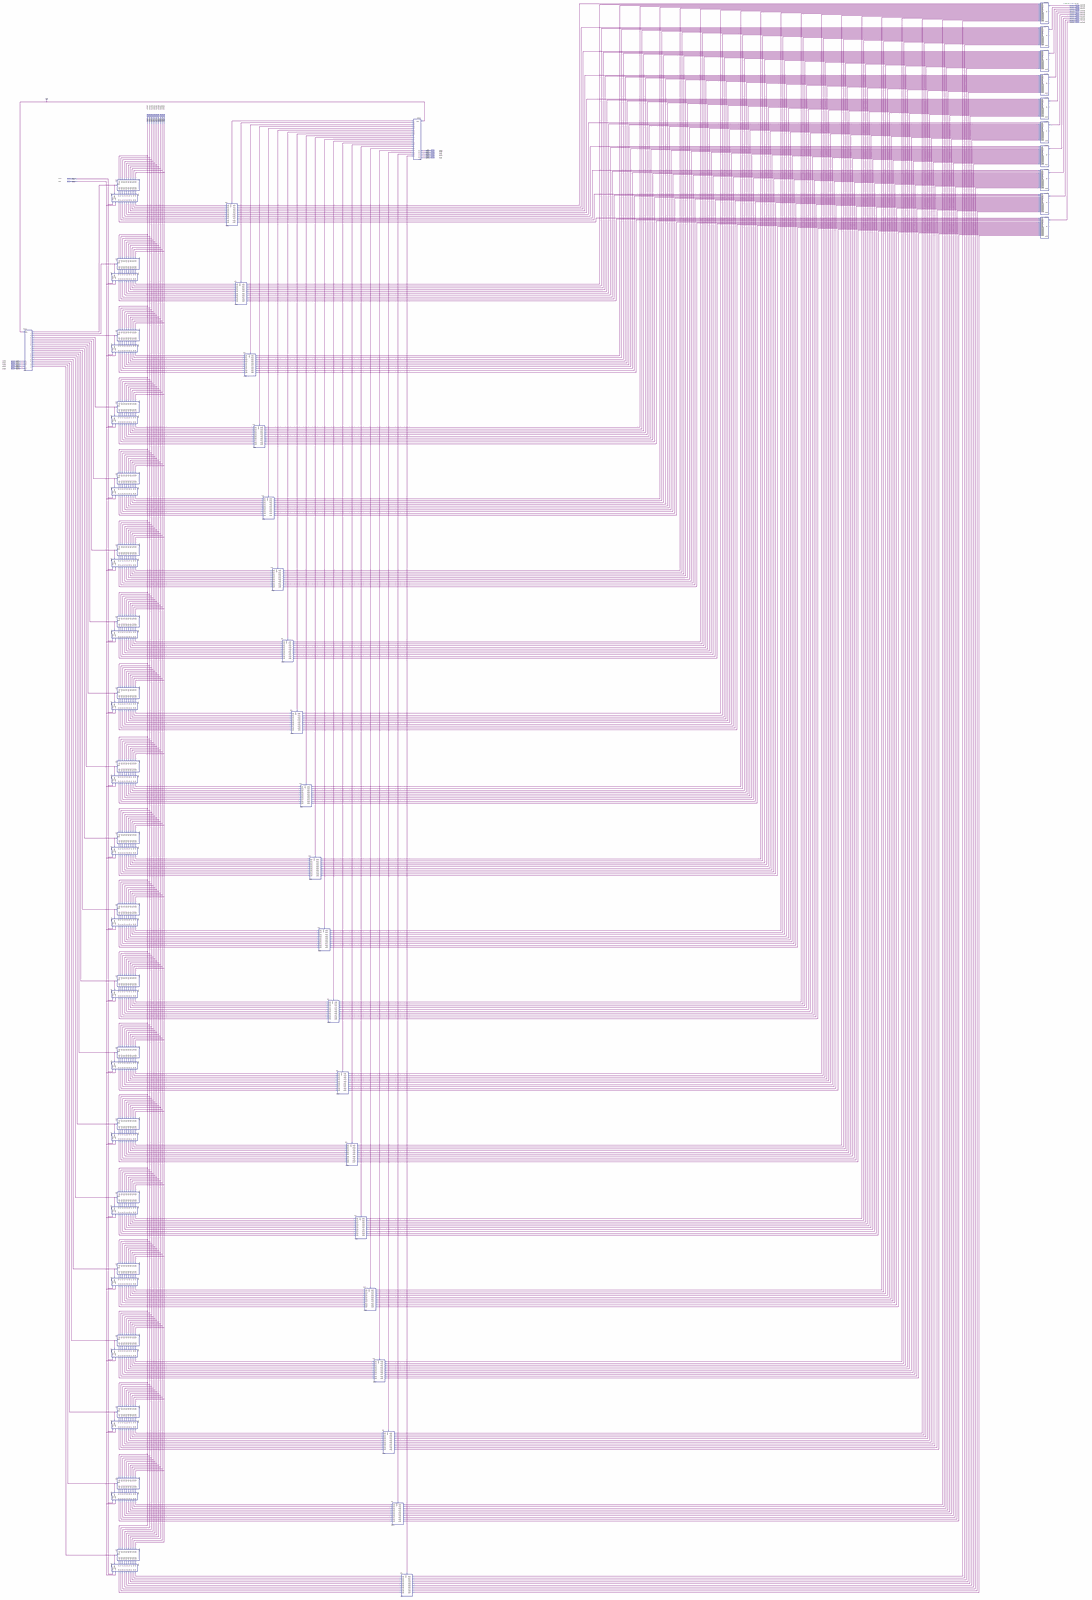
[diagram p0: schematic sheet, whole]
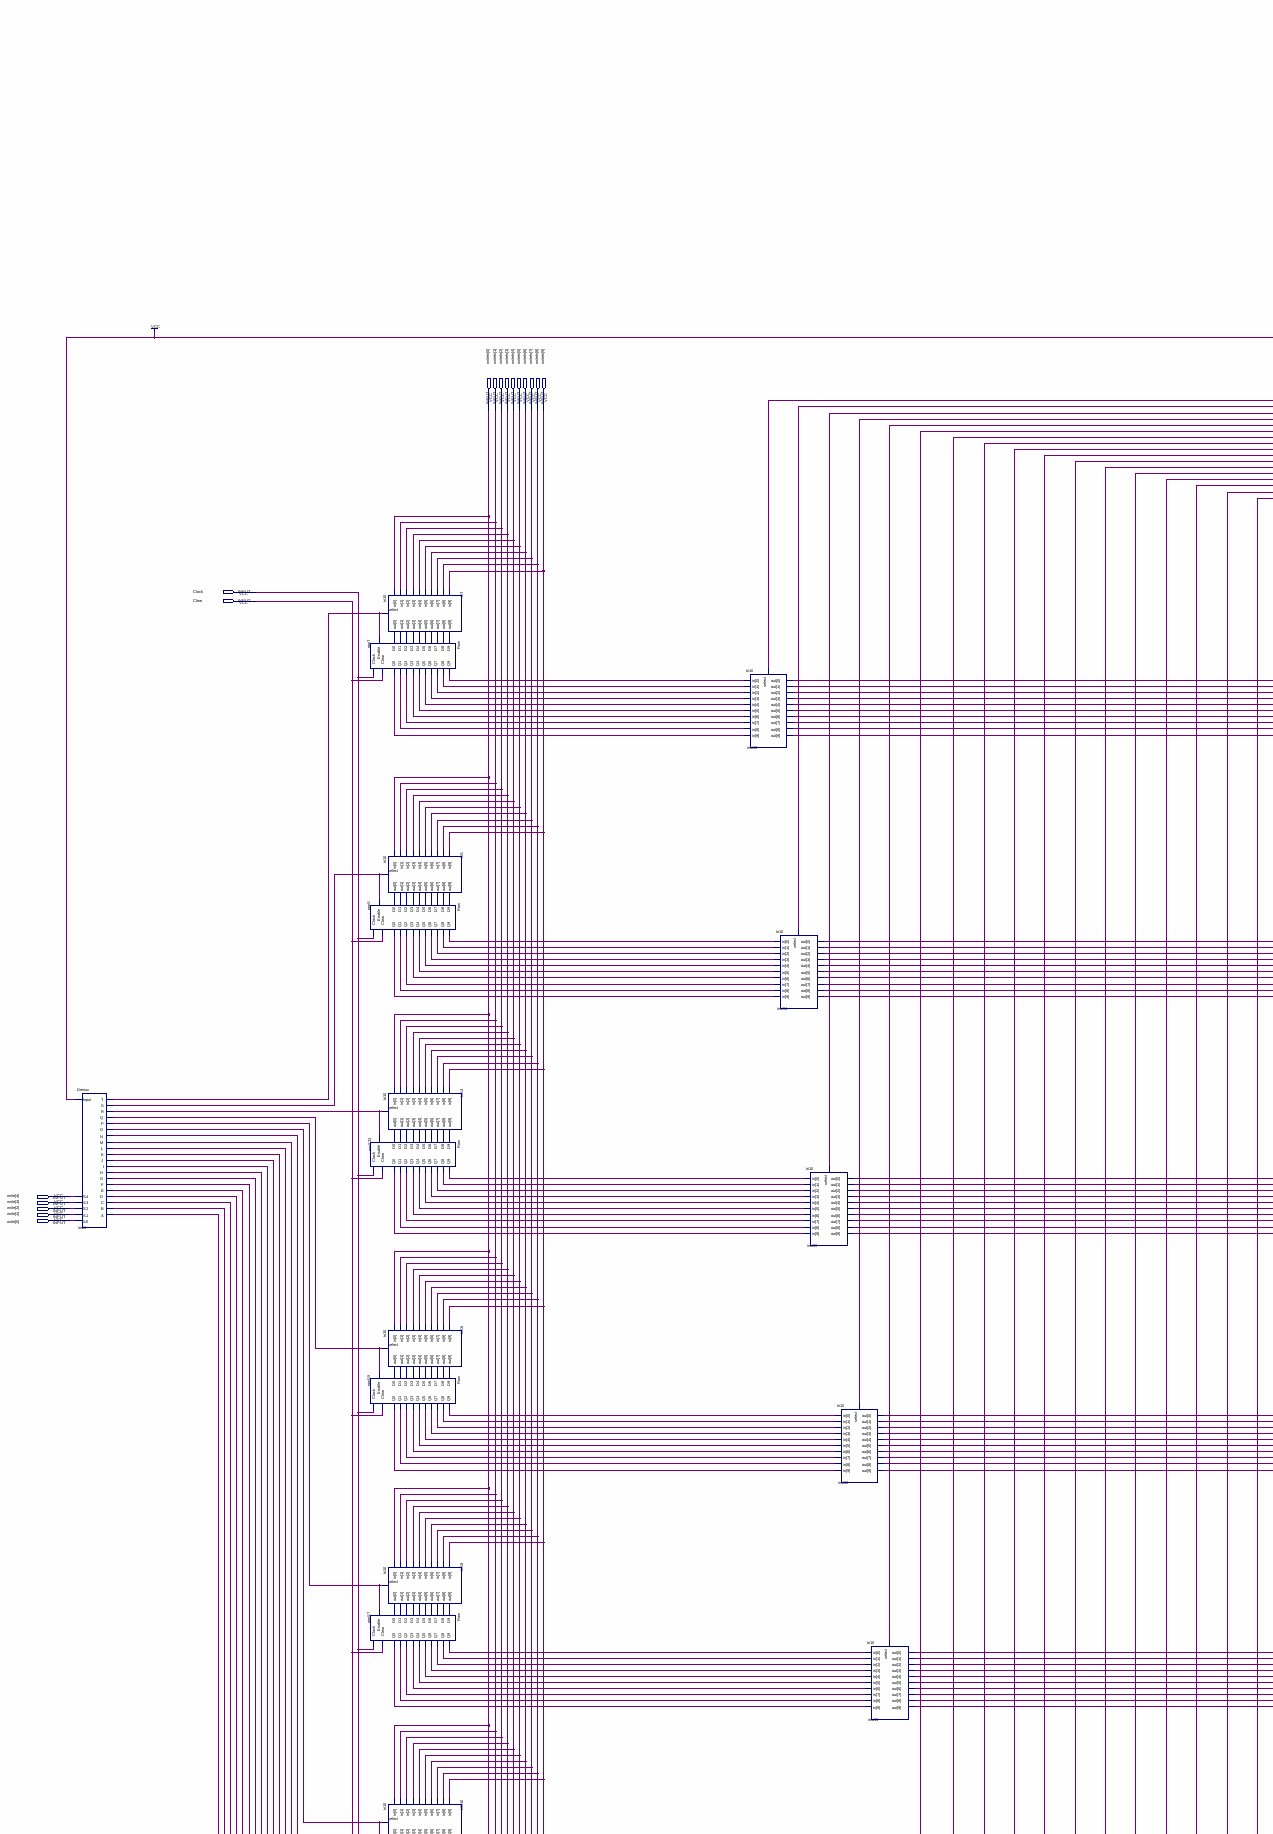
[diagram p1: schematic sheet, upper left part]
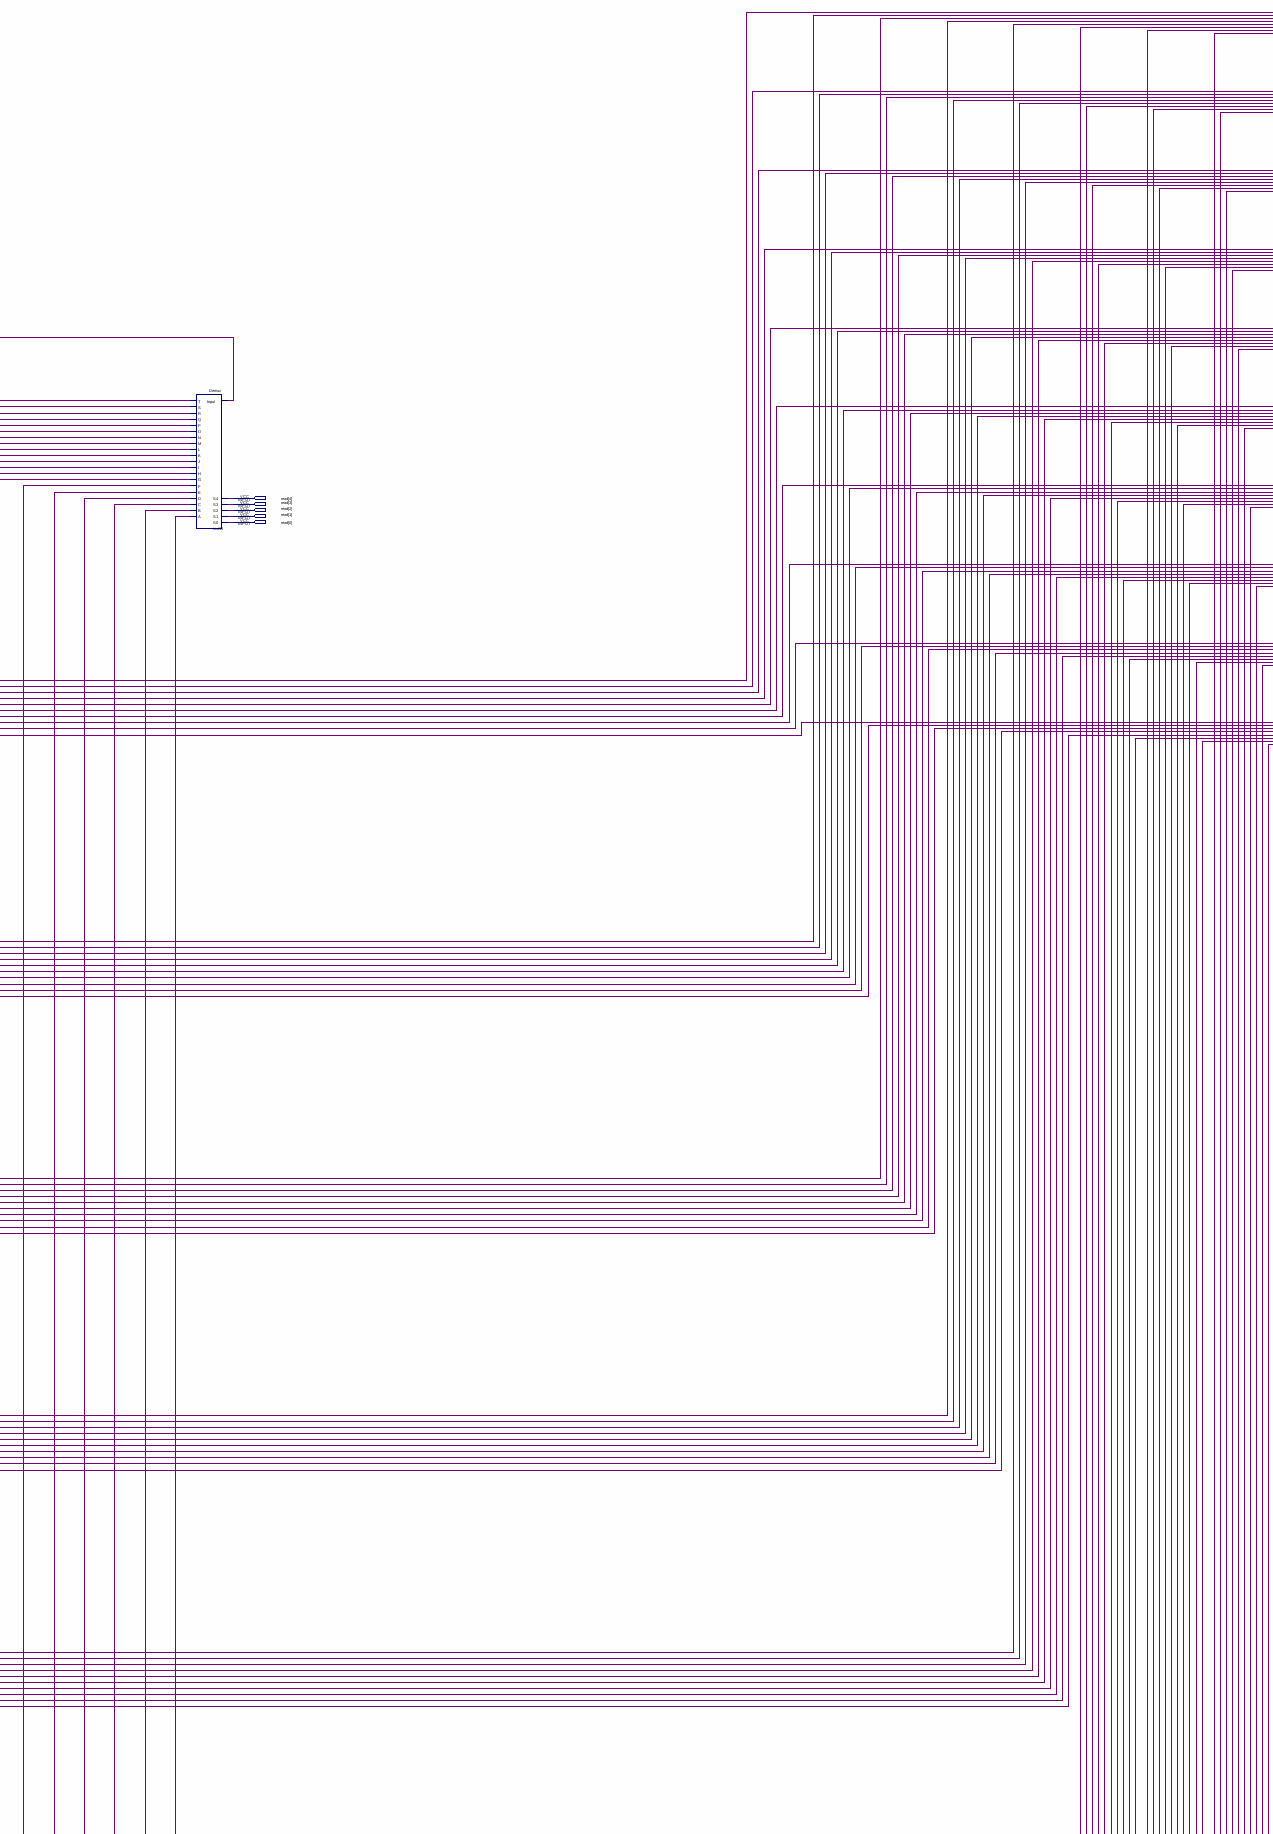
[diagram p2: schematic sheet, upper centre part]
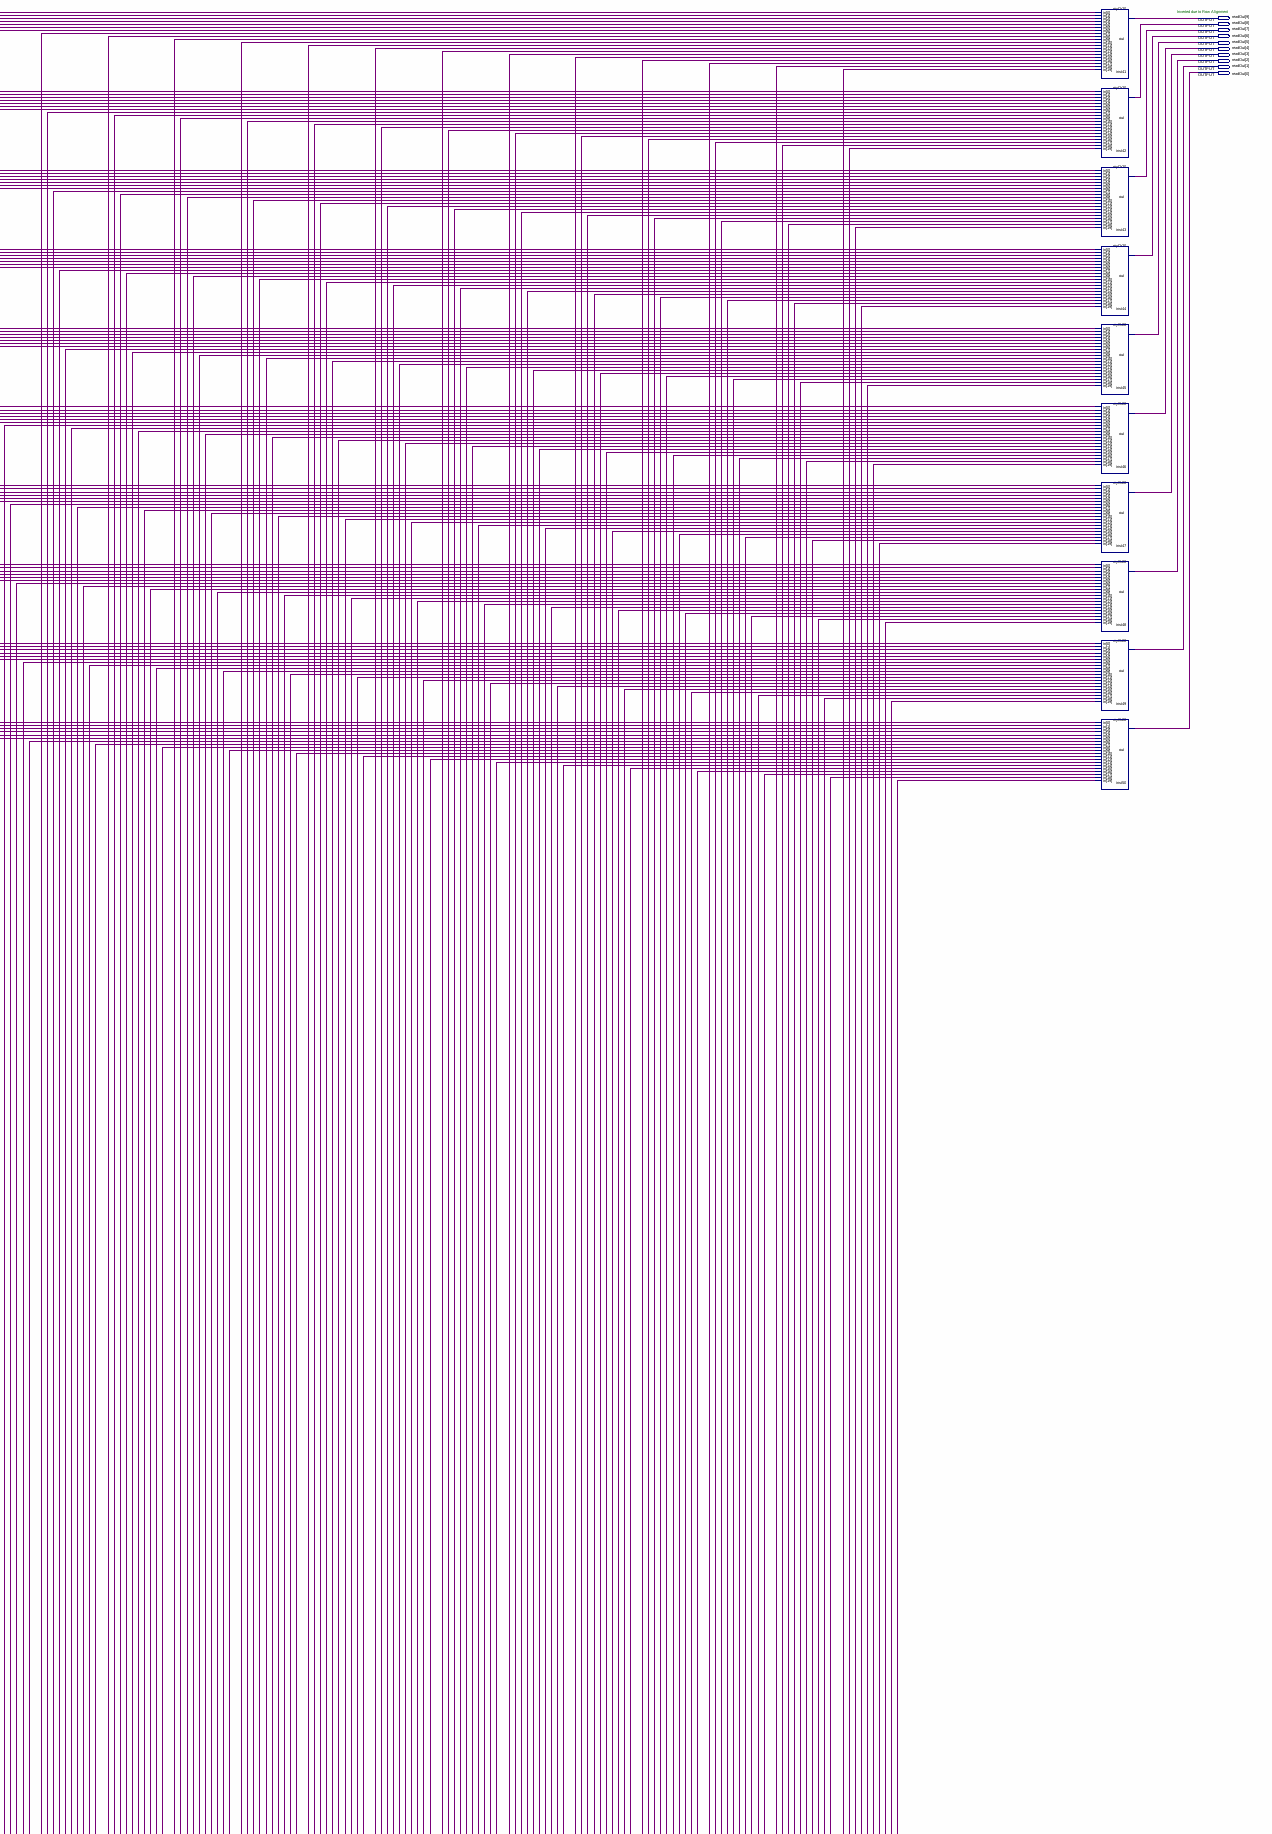
[diagram p3: schematic sheet, upper right part]
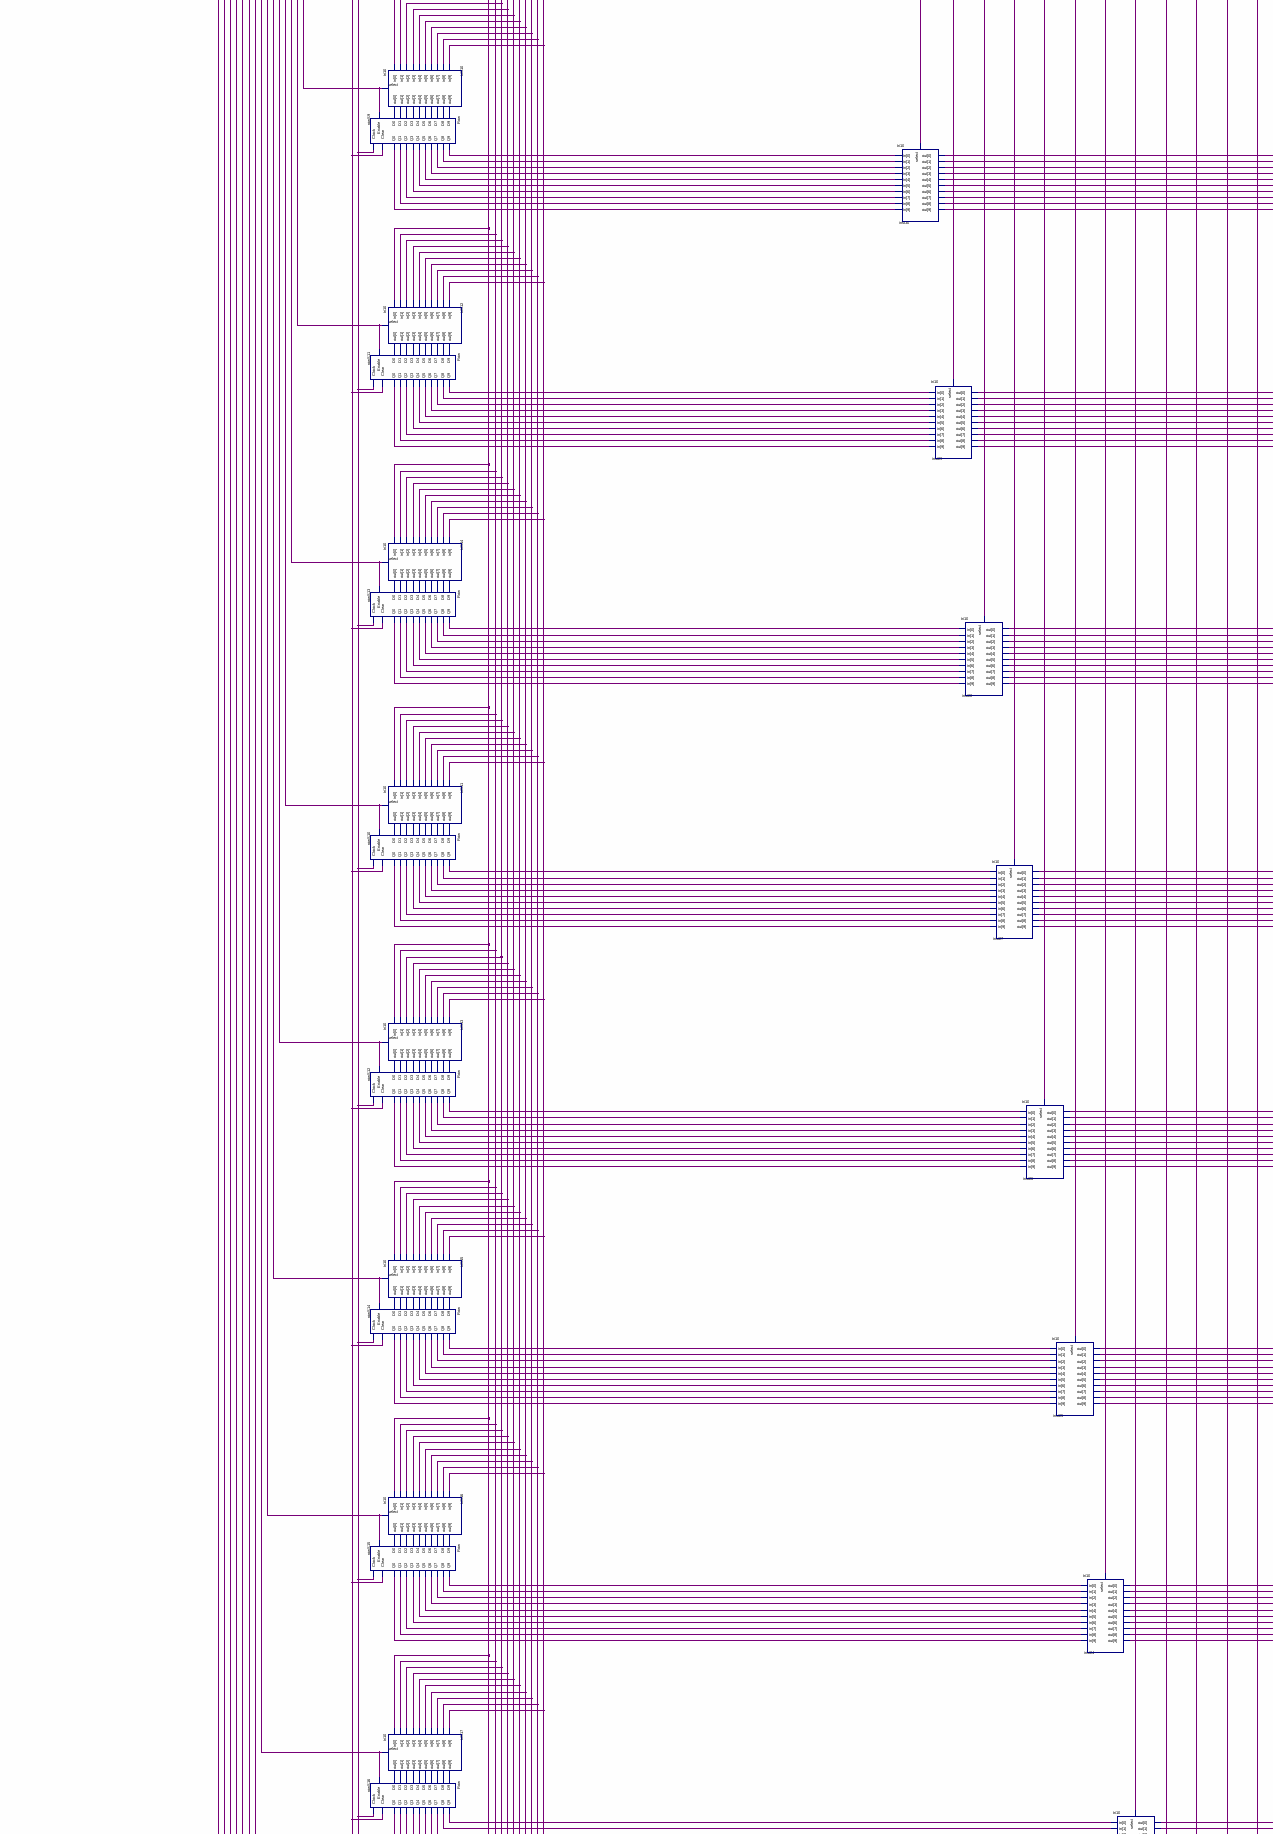
[diagram p4: schematic sheet, middle left part]
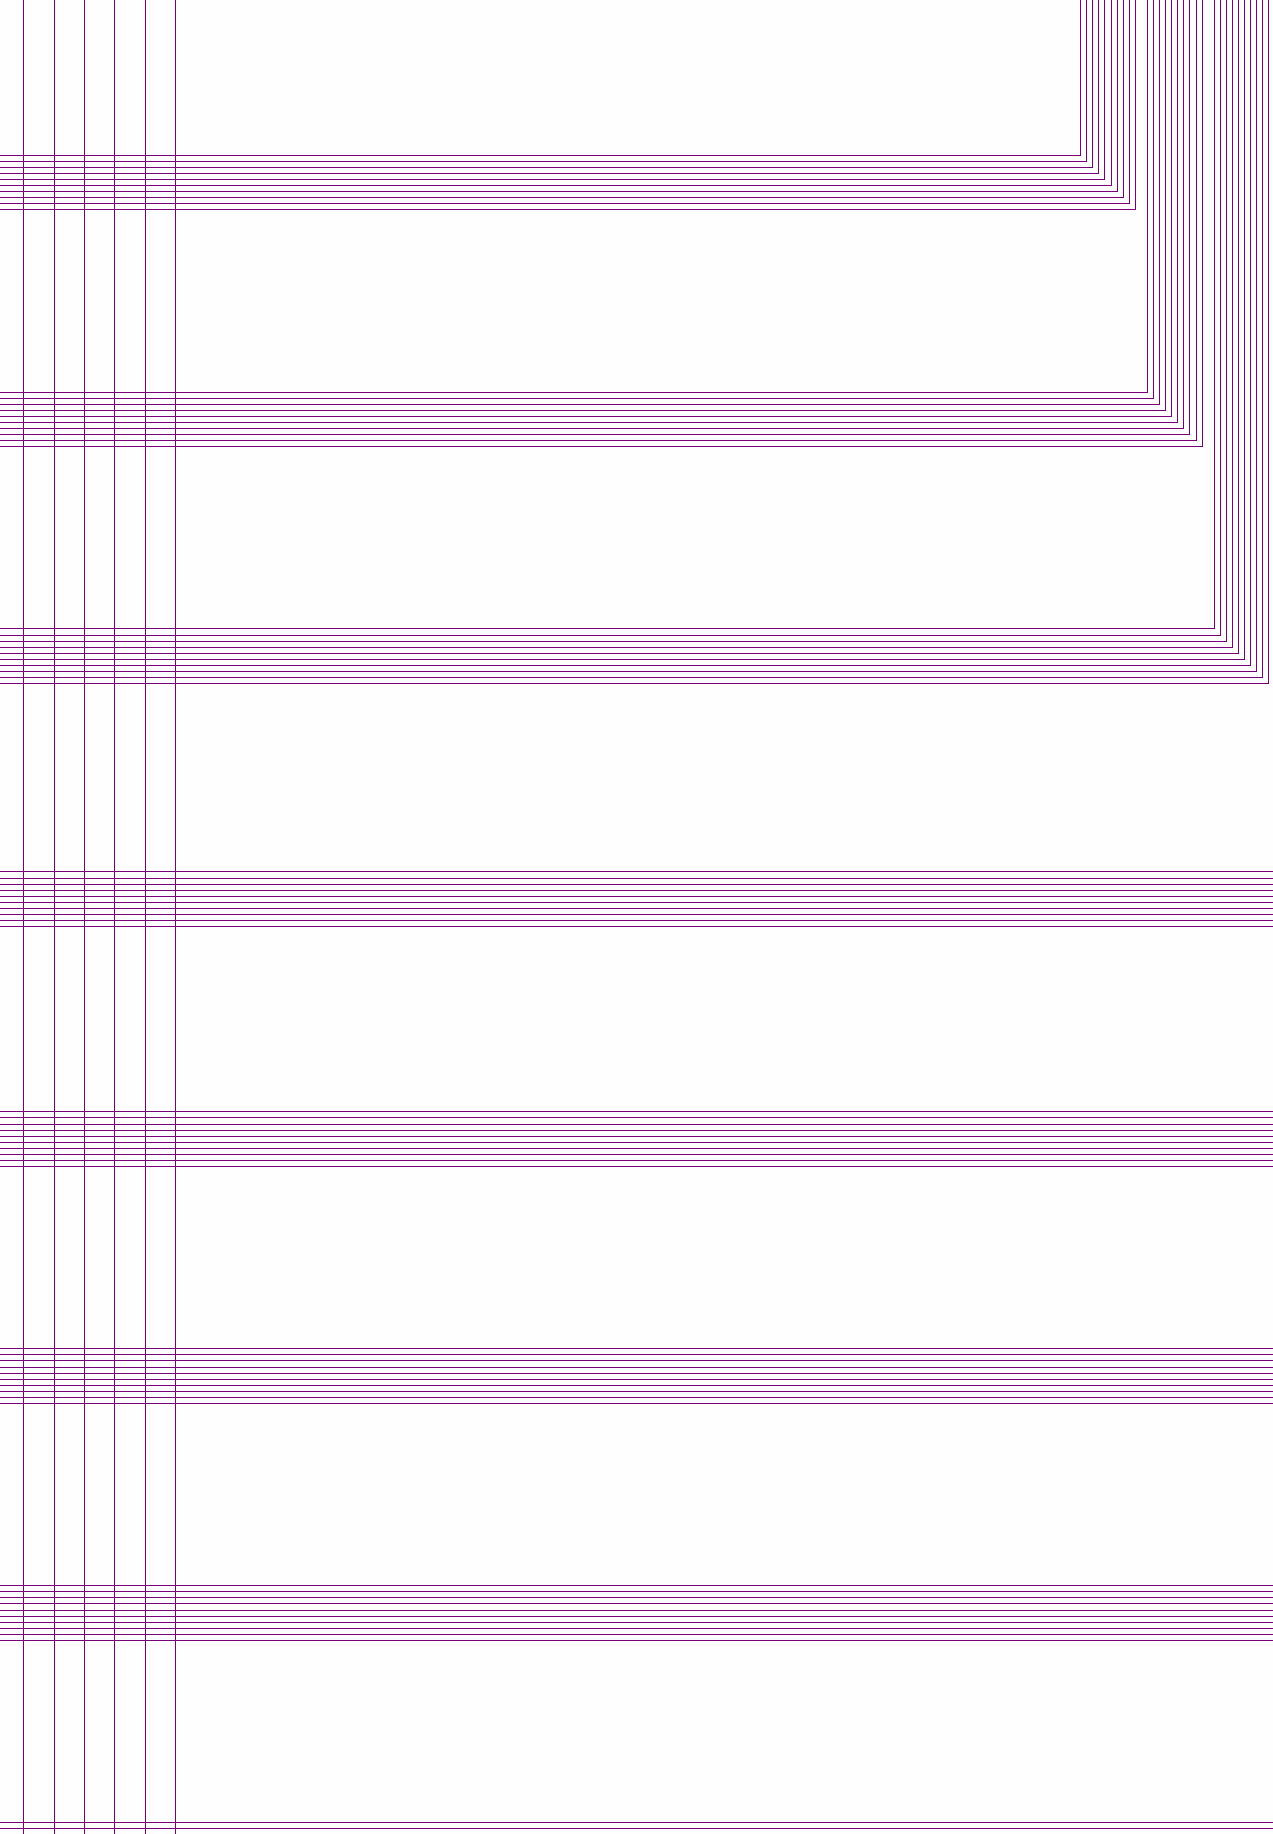
[diagram p5: schematic sheet, middle centre part]
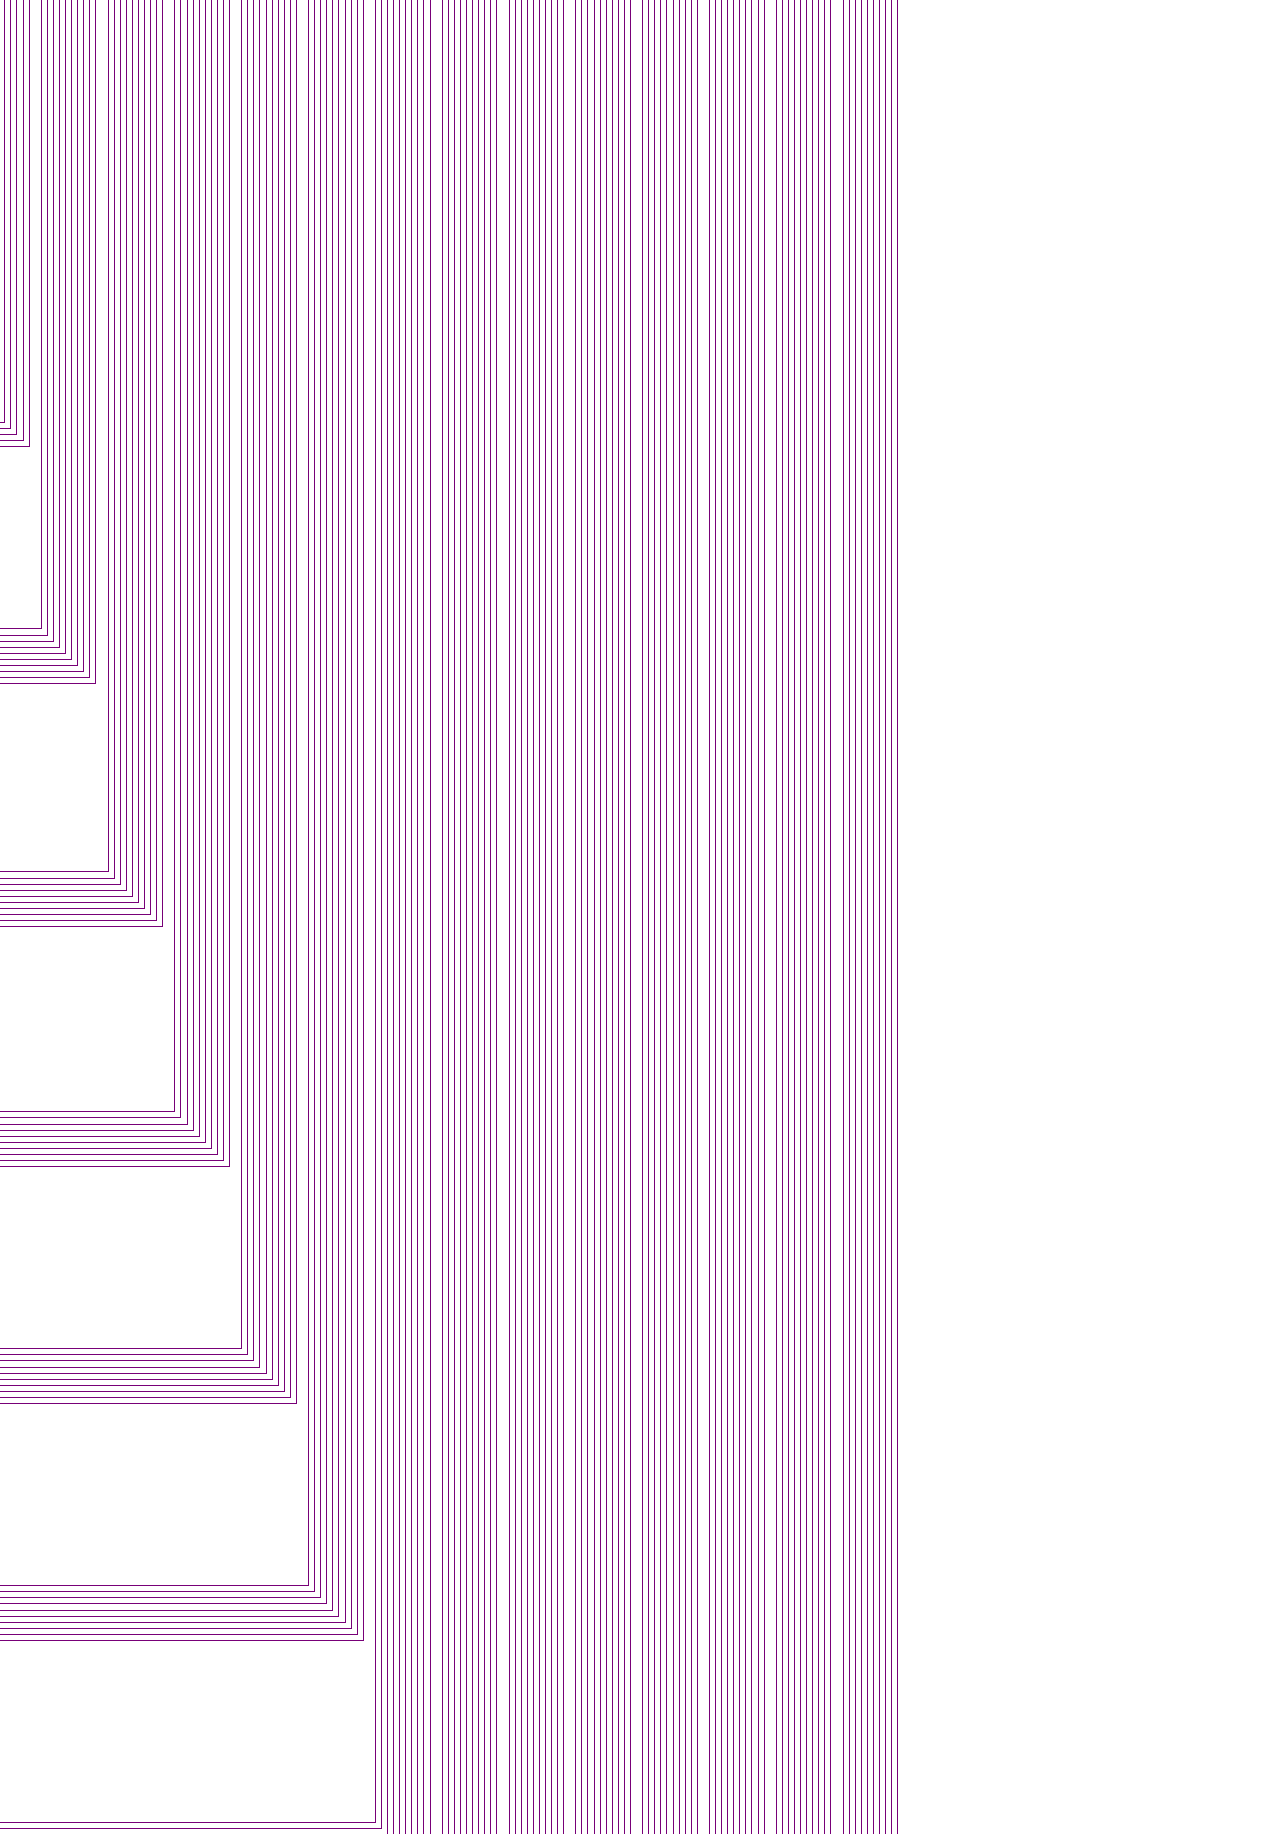
[diagram p6: schematic sheet, middle right part]
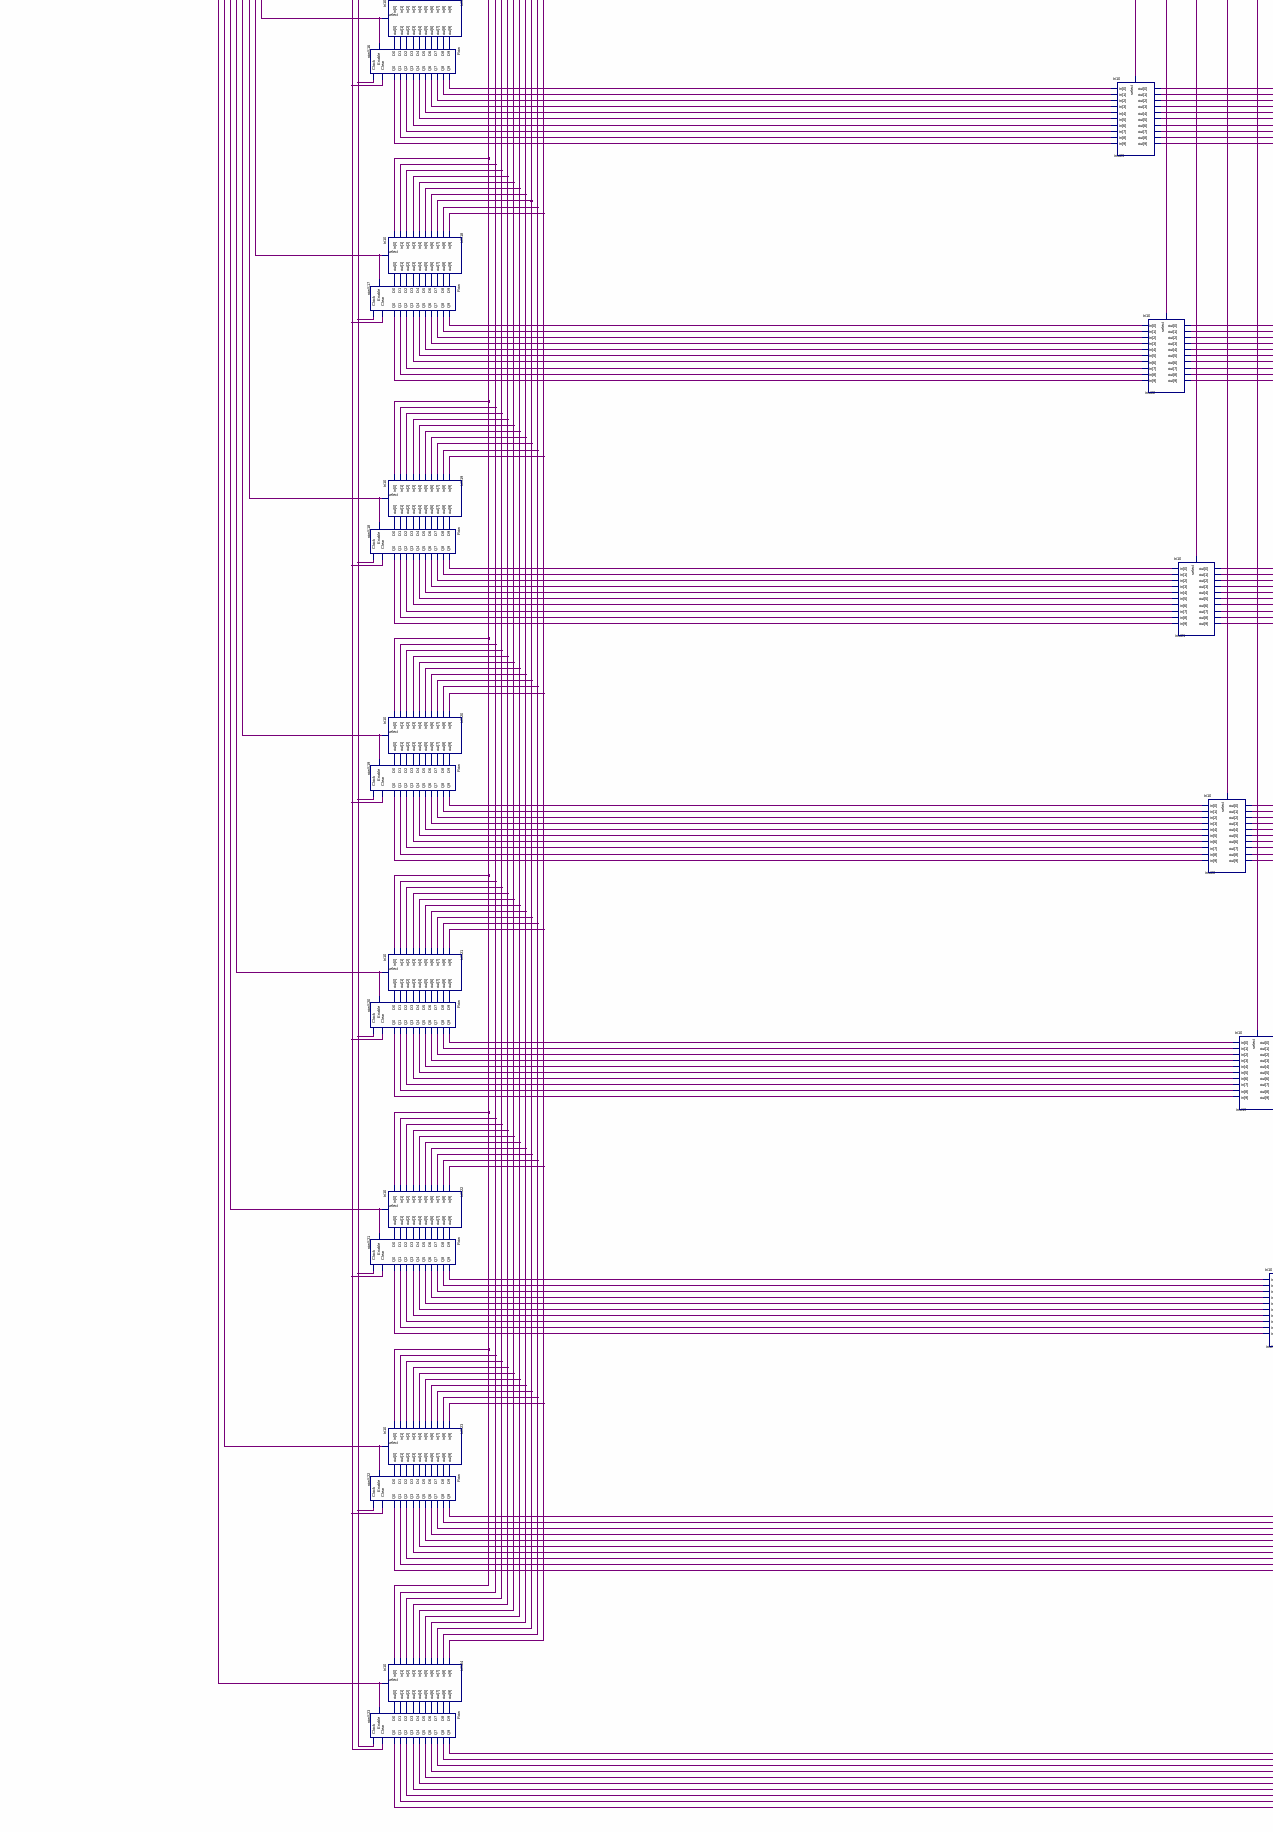
[diagram p7: schematic sheet, lower left part]
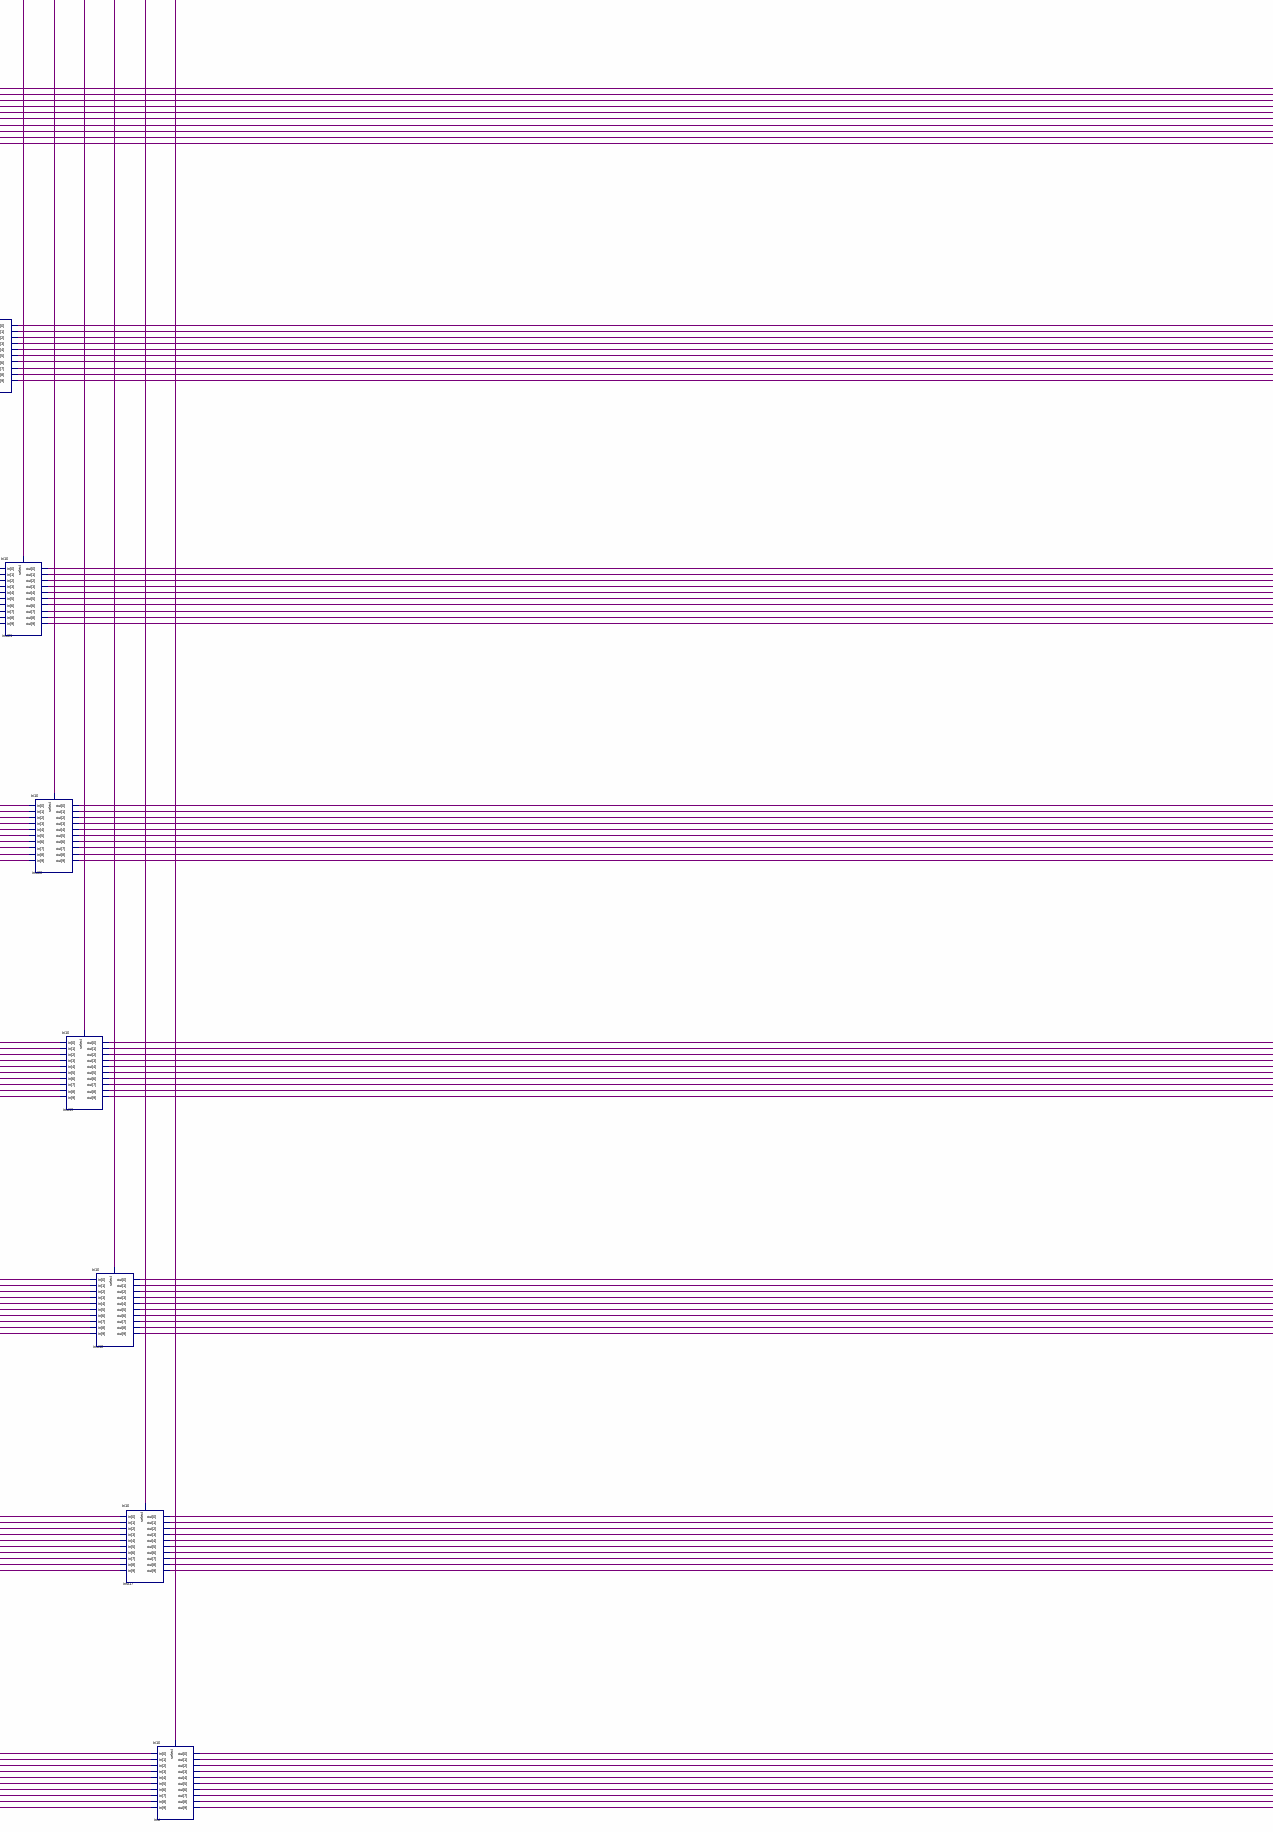
[diagram p8: schematic sheet, lower centre part]
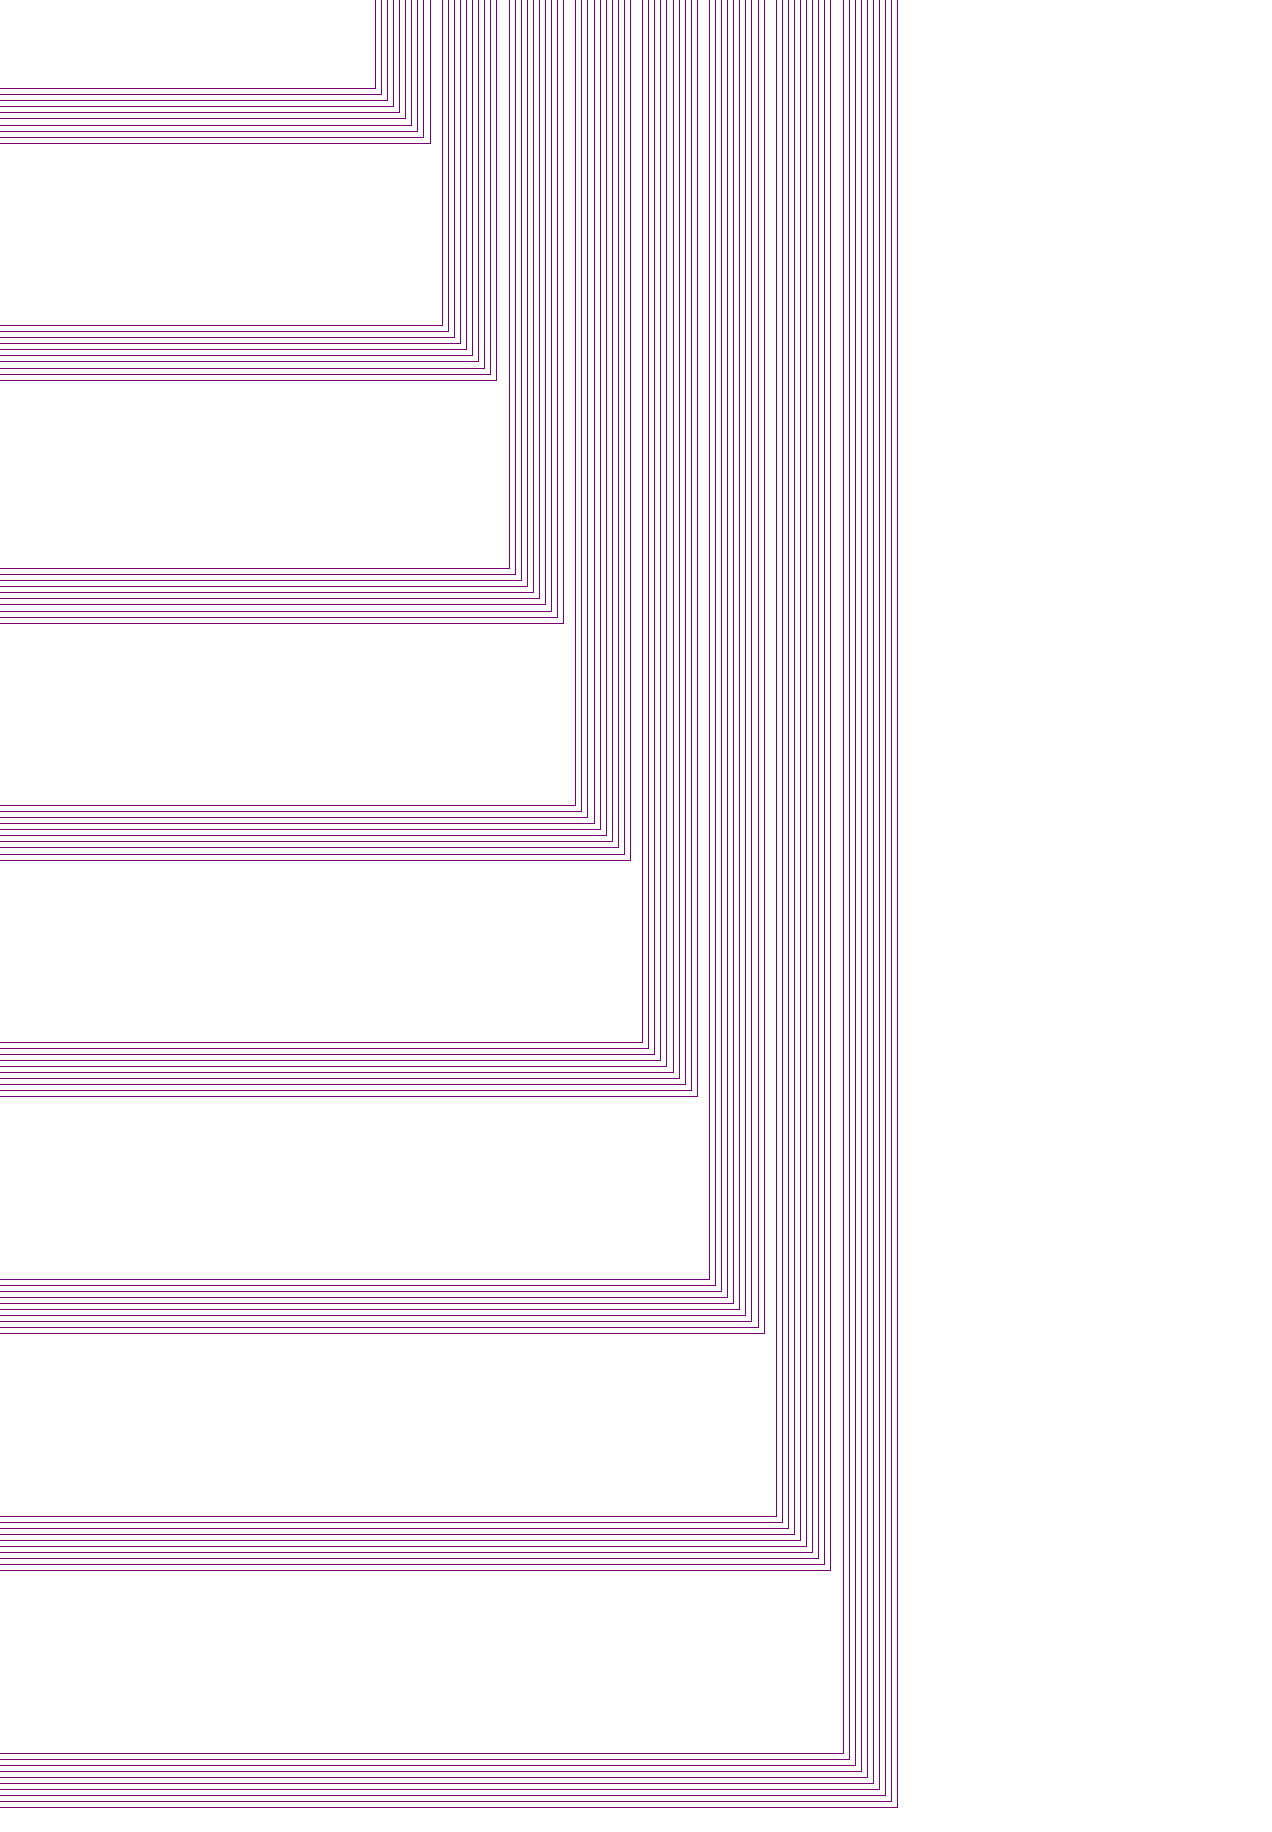
[diagram p9: schematic sheet, lower right part]
// Quartus schematic GameBoard.bdf as structural Verilog: 72 symbols, 32 pins
module GameBoard (
  input  [9:0] writeIn,
  input  [4:0] read,
  input  Clock,
  input  Clear,
  input  [4:0] write,
  output [9:0] readOut
);

  wire inst1_a, inst1_b, inst1_c, inst1_d, inst1_e, inst1_f, inst1_g, inst1_h, inst1_i, inst1_j, inst1_k,
       inst1_l, inst1_m, inst1_n, inst1_o, inst1_p, inst1_q, inst1_r, inst1_s, inst1_t, inst15_a, inst15_b,
       inst15_c, inst15_d, inst15_e, inst15_f, inst15_g, inst15_h, inst15_i, inst15_j, inst15_k, inst15_l,
       inst15_m, inst15_n, inst15_o, inst15_p, inst15_q, inst15_r, inst15_s, inst15_t, inst17_out,
       inst17_out_2, inst17_out_3, inst17_out_4, inst17_out_5, inst17_out_6, inst17_out_7, inst17_out_8,
       inst17_out_9, inst17_out_10, inst18_out, inst18_out_2, inst18_out_3, inst18_out_4, inst18_out_5,
       inst18_out_6, inst18_out_7, inst18_out_8, inst18_out_9, inst18_out_10, inst19_out, inst19_out_2,
       inst19_out_3, inst19_out_4, inst19_out_5, inst19_out_6, inst19_out_7, inst19_out_8, inst19_out_9,
       inst19_out_10, inst20_out, inst20_out_2, inst20_out_3, inst20_out_4, inst20_out_5, inst20_out_6,
       inst20_out_7, inst20_out_8, inst20_out_9, inst20_out_10, inst21_out, inst21_out_2, inst21_out_3,
       inst21_out_4, inst21_out_5, inst21_out_6, inst21_out_7, inst21_out_8, inst21_out_9, inst21_out_10,
       inst22_out, inst22_out_2, inst22_out_3, inst22_out_4, inst22_out_5, inst22_out_6, inst22_out_7,
       inst22_out_8, inst22_out_9, inst22_out_10, inst23_out, inst23_out_2, inst23_out_3, inst23_out_4,
       inst23_out_5, inst23_out_6, inst23_out_7, inst23_out_8, inst23_out_9, inst23_out_10, inst24_out,
       inst24_out_2, inst24_out_3, inst24_out_4, inst24_out_5, inst24_out_6, inst24_out_7, inst24_out_8,
       inst24_out_9, inst24_out_10, inst25_out, inst25_out_2, inst25_out_3, inst25_out_4, inst25_out_5,
       inst25_out_6, inst25_out_7, inst25_out_8, inst25_out_9, inst25_out_10, inst26_out, inst26_out_2,
       inst26_out_3, inst26_out_4, inst26_out_5, inst26_out_6, inst26_out_7, inst26_out_8, inst26_out_9,
       inst26_out_10, inst27_out, inst27_out_2, inst27_out_3, inst27_out_4, inst27_out_5, inst27_out_6,
       inst27_out_7, inst27_out_8, inst27_out_9, inst27_out_10, inst28_out, inst28_out_2, inst28_out_3,
       inst28_out_4, inst28_out_5, inst28_out_6, inst28_out_7, inst28_out_8, inst28_out_9, inst28_out_10,
       inst29_out, inst29_out_2, inst29_out_3, inst29_out_4, inst29_out_5, inst29_out_6, inst29_out_7,
       inst29_out_8, inst29_out_9, inst29_out_10, inst30_out, inst30_out_2, inst30_out_3, inst30_out_4,
       inst30_out_5, inst30_out_6, inst30_out_7, inst30_out_8, inst30_out_9, inst30_out_10, inst31_out,
       inst31_out_2, inst31_out_3, inst31_out_4, inst31_out_5, inst31_out_6, inst31_out_7, inst31_out_8,
       inst31_out_9, inst31_out_10, inst32_out, inst32_out_2, inst32_out_3, inst32_out_4, inst32_out_5,
       inst32_out_6, inst32_out_7, inst32_out_8, inst32_out_9, inst32_out_10, inst33_out, inst33_out_2,
       inst33_out_3, inst33_out_4, inst33_out_5, inst33_out_6, inst33_out_7, inst33_out_8, inst33_out_9,
       inst33_out_10, inst34_out, inst34_out_2, inst34_out_3, inst34_out_4, inst34_out_5, inst34_out_6,
       inst34_out_7, inst34_out_8, inst34_out_9, inst34_out_10, inst35_out, inst35_out_2, inst35_out_3,
       inst35_out_4, inst35_out_5, inst35_out_6, inst35_out_7, inst35_out_8, inst35_out_9, inst35_out_10,
       inst_out, inst_out_2, inst_out_3, inst_out_4, inst_out_5, inst_out_6, inst_out_7, inst_out_8,
       inst_out_9, inst_out_10, rowS5_q0, rowS5_q1, rowS5_q2, rowS5_q3, rowS5_q4, rowS5_q5, rowS5_q6,
       rowS5_q7, rowS5_q8, rowS5_q9, rowS7_q0, rowS7_q1, rowS7_q2, rowS7_q3, rowS7_q4, rowS7_q5, rowS7_q6,
       rowS7_q7, rowS7_q8, rowS7_q9, rowS9_q0, rowS9_q1, rowS9_q2, rowS9_q3, rowS9_q4, rowS9_q5, rowS9_q6,
       rowS9_q7, rowS9_q8, rowS9_q9, rowS10_q0, rowS10_q1, rowS10_q2, rowS10_q3, rowS10_q4, rowS10_q5,
       rowS10_q6, rowS10_q7, rowS10_q8, rowS10_q9, rowS11_q0, rowS11_q1, rowS11_q2, rowS11_q3, rowS11_q4,
       rowS11_q5, rowS11_q6, rowS11_q7, rowS11_q8, rowS11_q9, rowS12_q0, rowS12_q1, rowS12_q2, rowS12_q3,
       rowS12_q4, rowS12_q5, rowS12_q6, rowS12_q7, rowS12_q8, rowS12_q9, rowS13_q0, rowS13_q1, rowS13_q2,
       rowS13_q3, rowS13_q4, rowS13_q5, rowS13_q6, rowS13_q7, rowS13_q8, rowS13_q9, rowS14_q0, rowS14_q1,
       rowS14_q2, rowS14_q3, rowS14_q4, rowS14_q5, rowS14_q6, rowS14_q7, rowS14_q8, rowS14_q9, rowS15_q0,
       rowS15_q1, rowS15_q2, rowS15_q3, rowS15_q4, rowS15_q5, rowS15_q6, rowS15_q7, rowS15_q8, rowS15_q9,
       rowS16_q0, rowS16_q1, rowS16_q2, rowS16_q3, rowS16_q4, rowS16_q5, rowS16_q6, rowS16_q7, rowS16_q8,
       rowS16_q9, rowS17_q0, rowS17_q1, rowS17_q2, rowS17_q3, rowS17_q4, rowS17_q5, rowS17_q6, rowS17_q7,
       rowS17_q8, rowS17_q9, rowS18_q0, rowS18_q1, rowS18_q2, rowS18_q3, rowS18_q4, rowS18_q5, rowS18_q6,
       rowS18_q7, rowS18_q8, rowS18_q9, rowS19_q0, rowS19_q1, rowS19_q2, rowS19_q3, rowS19_q4, rowS19_q5,
       rowS19_q6, rowS19_q7, rowS19_q8, rowS19_q9, rowS20_q0, rowS20_q1, rowS20_q2, rowS20_q3, rowS20_q4,
       rowS20_q5, rowS20_q6, rowS20_q7, rowS20_q8, rowS20_q9, rowS21_q0, rowS21_q1, rowS21_q2, rowS21_q3,
       rowS21_q4, rowS21_q5, rowS21_q6, rowS21_q7, rowS21_q8, rowS21_q9, rowS22_q0, rowS22_q1, rowS22_q2,
       rowS22_q3, rowS22_q4, rowS22_q5, rowS22_q6, rowS22_q7, rowS22_q8, rowS22_q9, rowS23_q0, rowS23_q1,
       rowS23_q2, rowS23_q3, rowS23_q4, rowS23_q5, rowS23_q6, rowS23_q7, rowS23_q8, rowS23_q9, rowS33_q0,
       rowS33_q1, rowS33_q2, rowS33_q3, rowS33_q4, rowS33_q5, rowS33_q6, rowS33_q7, rowS33_q8, rowS33_q9,
       rowS_q0, rowS_q1, rowS_q2, rowS_q3, rowS_q4, rowS_q5, rowS_q6, rowS_q7, rowS_q8, rowS_q9, rowT_q0,
       rowT_q1, rowT_q2, rowT_q3, rowT_q4, rowT_q5, rowT_q6, rowT_q7, rowT_q8, rowT_q9, triS4_out,
       triS4_out_2, triS4_out_3, triS4_out_4, triS4_out_5, triS4_out_6, triS4_out_7, triS4_out_8,
       triS4_out_9, triS4_out_10, triS6_out, triS6_out_2, triS6_out_3, triS6_out_4, triS6_out_5, triS6_out_6,
       triS6_out_7, triS6_out_8, triS6_out_9, triS6_out_10, triS8_out, triS8_out_2, triS8_out_3, triS8_out_4,
       triS8_out_5, triS8_out_6, triS8_out_7, triS8_out_8, triS8_out_9, triS8_out_10, triS10_out,
       triS10_out_2, triS10_out_3, triS10_out_4, triS10_out_5, triS10_out_6, triS10_out_7, triS10_out_8,
       triS10_out_9, triS10_out_10, triS11_out, triS11_out_2, triS11_out_3, triS11_out_4, triS11_out_5,
       triS11_out_6, triS11_out_7, triS11_out_8, triS11_out_9, triS11_out_10, triS12_out, triS12_out_2,
       triS12_out_3, triS12_out_4, triS12_out_5, triS12_out_6, triS12_out_7, triS12_out_8, triS12_out_9,
       triS12_out_10, triS13_out, triS13_out_2, triS13_out_3, triS13_out_4, triS13_out_5, triS13_out_6,
       triS13_out_7, triS13_out_8, triS13_out_9, triS13_out_10, triS14_out, triS14_out_2, triS14_out_3,
       triS14_out_4, triS14_out_5, triS14_out_6, triS14_out_7, triS14_out_8, triS14_out_9, triS14_out_10,
       triS15_out, triS15_out_2, triS15_out_3, triS15_out_4, triS15_out_5, triS15_out_6, triS15_out_7,
       triS15_out_8, triS15_out_9, triS15_out_10, triS16_out, triS16_out_2, triS16_out_3, triS16_out_4,
       triS16_out_5, triS16_out_6, triS16_out_7, triS16_out_8, triS16_out_9, triS16_out_10, triS17_out,
       triS17_out_2, triS17_out_3, triS17_out_4, triS17_out_5, triS17_out_6, triS17_out_7, triS17_out_8,
       triS17_out_9, triS17_out_10, triS18_out, triS18_out_2, triS18_out_3, triS18_out_4, triS18_out_5,
       triS18_out_6, triS18_out_7, triS18_out_8, triS18_out_9, triS18_out_10, triS19_out, triS19_out_2,
       triS19_out_3, triS19_out_4, triS19_out_5, triS19_out_6, triS19_out_7, triS19_out_8, triS19_out_9,
       triS19_out_10, triS20_out, triS20_out_2, triS20_out_3, triS20_out_4, triS20_out_5, triS20_out_6,
       triS20_out_7, triS20_out_8, triS20_out_9, triS20_out_10, triS21_out, triS21_out_2, triS21_out_3,
       triS21_out_4, triS21_out_5, triS21_out_6, triS21_out_7, triS21_out_8, triS21_out_9, triS21_out_10,
       triS22_out, triS22_out_2, triS22_out_3, triS22_out_4, triS22_out_5, triS22_out_6, triS22_out_7,
       triS22_out_8, triS22_out_9, triS22_out_10, triS23_out, triS23_out_2, triS23_out_3, triS23_out_4,
       triS23_out_5, triS23_out_6, triS23_out_7, triS23_out_8, triS23_out_9, triS23_out_10, triS24_out,
       triS24_out_2, triS24_out_3, triS24_out_4, triS24_out_5, triS24_out_6, triS24_out_7, triS24_out_8,
       triS24_out_9, triS24_out_10, triS_out, triS_out_2, triS_out_3, triS_out_4, triS_out_5, triS_out_6,
       triS_out_7, triS_out_8, triS_out_9, triS_out_10, triT_out, triT_out_2, triT_out_3, triT_out_4,
       triT_out_5, triT_out_6, triT_out_7, triT_out_8, triT_out_9, triT_out_10;

  Demux inst1 (
    .S4(write[4]), .S3(write[3]), .S2(write[2]), .S1(write[1]), .S0(write[0]), .Input(1'b1), .T(inst1_t),
    .S(inst1_s), .R(inst1_r), .Q(inst1_q), .P(inst1_p), .O(inst1_o), .N(inst1_n), .M(inst1_m), .L(inst1_l),
    .K(inst1_k), .J(inst1_j), .I(inst1_i), .H(inst1_h), .G(inst1_g), .F(inst1_f), .E(inst1_e), .D(inst1_d),
    .C(inst1_c), .B(inst1_b), .A(inst1_a));
  tri10 triT (
    .in(writeIn), .select(inst1_t),
    .out({triT_out_10, triT_out_9, triT_out_8, triT_out_7, triT_out_6, triT_out_5, triT_out_4, triT_out_3, triT_out_2, triT_out}));
  Row rowT (
    .D1(triT_out_2), .D3(triT_out_4), .D4(triT_out_5), .D5(triT_out_6), .D6(triT_out_7), .D7(triT_out_8),
    .D0(triT_out), .D2(triT_out_3), .D9(triT_out_10), .D8(triT_out_9), .Enable(inst1_t), .Clock(Clock),
    .Clear(Clear), .Q0(rowT_q0), .Q1(rowT_q1), .Q2(rowT_q2), .Q3(rowT_q3), .Q4(rowT_q4), .Q5(rowT_q5),
    .Q6(rowT_q6), .Q7(rowT_q7), .Q8(rowT_q8), .Q9(rowT_q9));
  tri10 triS (
    .in(writeIn), .select(inst1_s),
    .out({triS_out_10, triS_out_9, triS_out_8, triS_out_7, triS_out_6, triS_out_5, triS_out_4, triS_out_3, triS_out_2, triS_out}));
  Row rowS (
    .D1(triS_out_2), .D3(triS_out_4), .D4(triS_out_5), .D5(triS_out_6), .D6(triS_out_7), .D7(triS_out_8),
    .D0(triS_out), .D2(triS_out_3), .D9(triS_out_10), .D8(triS_out_9), .Enable(inst1_s), .Clock(Clock),
    .Clear(Clear), .Q0(rowS_q0), .Q1(rowS_q1), .Q2(rowS_q2), .Q3(rowS_q3), .Q4(rowS_q4), .Q5(rowS_q5),
    .Q6(rowS_q6), .Q7(rowS_q7), .Q8(rowS_q8), .Q9(rowS_q9));
  tri10 triS4 (
    .in(writeIn), .select(inst1_r),
    .out({triS4_out_10, triS4_out_9, triS4_out_8, triS4_out_7, triS4_out_6, triS4_out_5, triS4_out_4, triS4_out_3, triS4_out_2, triS4_out}));
  Row rowS33 (
    .D1(triS4_out_2), .D3(triS4_out_4), .D4(triS4_out_5), .D5(triS4_out_6), .D6(triS4_out_7),
    .D7(triS4_out_8), .D0(triS4_out), .D2(triS4_out_3), .D9(triS4_out_10), .D8(triS4_out_9),
    .Enable(inst1_r), .Clock(Clock), .Clear(Clear), .Q0(rowS33_q0), .Q1(rowS33_q1), .Q2(rowS33_q2),
    .Q3(rowS33_q3), .Q4(rowS33_q4), .Q5(rowS33_q5), .Q6(rowS33_q6), .Q7(rowS33_q7), .Q8(rowS33_q8),
    .Q9(rowS33_q9));
  tri10 triS6 (
    .in(writeIn), .select(inst1_q),
    .out({triS6_out_10, triS6_out_9, triS6_out_8, triS6_out_7, triS6_out_6, triS6_out_5, triS6_out_4, triS6_out_3, triS6_out_2, triS6_out}));
  Row rowS5 (
    .D1(triS6_out_2), .D3(triS6_out_4), .D4(triS6_out_5), .D5(triS6_out_6), .D6(triS6_out_7),
    .D7(triS6_out_8), .D0(triS6_out), .D2(triS6_out_3), .D9(triS6_out_10), .D8(triS6_out_9),
    .Enable(inst1_q), .Clock(Clock), .Clear(Clear), .Q0(rowS5_q0), .Q1(rowS5_q1), .Q2(rowS5_q2),
    .Q3(rowS5_q3), .Q4(rowS5_q4), .Q5(rowS5_q5), .Q6(rowS5_q6), .Q7(rowS5_q7), .Q8(rowS5_q8), .Q9(rowS5_q9));
  tri10 triS8 (
    .in(writeIn), .select(inst1_p),
    .out({triS8_out_10, triS8_out_9, triS8_out_8, triS8_out_7, triS8_out_6, triS8_out_5, triS8_out_4, triS8_out_3, triS8_out_2, triS8_out}));
  Row rowS7 (
    .D1(triS8_out_2), .D3(triS8_out_4), .D4(triS8_out_5), .D5(triS8_out_6), .D6(triS8_out_7),
    .D7(triS8_out_8), .D0(triS8_out), .D2(triS8_out_3), .D9(triS8_out_10), .D8(triS8_out_9),
    .Enable(inst1_p), .Clock(Clock), .Clear(Clear), .Q0(rowS7_q0), .Q1(rowS7_q1), .Q2(rowS7_q2),
    .Q3(rowS7_q3), .Q4(rowS7_q4), .Q5(rowS7_q5), .Q6(rowS7_q6), .Q7(rowS7_q7), .Q8(rowS7_q8), .Q9(rowS7_q9));
  tri10 triS10 (
    .in(writeIn), .select(inst1_o),
    .out({triS10_out_10, triS10_out_9, triS10_out_8, triS10_out_7, triS10_out_6, triS10_out_5, triS10_out_4, triS10_out_3, triS10_out_2, triS10_out}));
  Row rowS9 (
    .D1(triS10_out_2), .D3(triS10_out_4), .D4(triS10_out_5), .D5(triS10_out_6), .D6(triS10_out_7),
    .D7(triS10_out_8), .D0(triS10_out), .D2(triS10_out_3), .D9(triS10_out_10), .D8(triS10_out_9),
    .Enable(inst1_o), .Clock(Clock), .Clear(Clear), .Q0(rowS9_q0), .Q1(rowS9_q1), .Q2(rowS9_q2),
    .Q3(rowS9_q3), .Q4(rowS9_q4), .Q5(rowS9_q5), .Q6(rowS9_q6), .Q7(rowS9_q7), .Q8(rowS9_q8), .Q9(rowS9_q9));
  tri10 triS12 (
    .in(writeIn), .select(inst1_n),
    .out({triS12_out_10, triS12_out_9, triS12_out_8, triS12_out_7, triS12_out_6, triS12_out_5, triS12_out_4, triS12_out_3, triS12_out_2, triS12_out}));
  Row rowS11 (
    .D1(triS12_out_2), .D3(triS12_out_4), .D4(triS12_out_5), .D5(triS12_out_6), .D6(triS12_out_7),
    .D7(triS12_out_8), .D0(triS12_out), .D2(triS12_out_3), .D9(triS12_out_10), .D8(triS12_out_9),
    .Enable(inst1_n), .Clock(Clock), .Clear(Clear), .Q0(rowS11_q0), .Q1(rowS11_q1), .Q2(rowS11_q2),
    .Q3(rowS11_q3), .Q4(rowS11_q4), .Q5(rowS11_q5), .Q6(rowS11_q6), .Q7(rowS11_q7), .Q8(rowS11_q8),
    .Q9(rowS11_q9));
  tri10 triS14 (
    .in(writeIn), .select(inst1_m),
    .out({triS14_out_10, triS14_out_9, triS14_out_8, triS14_out_7, triS14_out_6, triS14_out_5, triS14_out_4, triS14_out_3, triS14_out_2, triS14_out}));
  Row rowS13 (
    .D1(triS14_out_2), .D3(triS14_out_4), .D4(triS14_out_5), .D5(triS14_out_6), .D6(triS14_out_7),
    .D7(triS14_out_8), .D0(triS14_out), .D2(triS14_out_3), .D9(triS14_out_10), .D8(triS14_out_9),
    .Enable(inst1_m), .Clock(Clock), .Clear(Clear), .Q0(rowS13_q0), .Q1(rowS13_q1), .Q2(rowS13_q2),
    .Q3(rowS13_q3), .Q4(rowS13_q4), .Q5(rowS13_q5), .Q6(rowS13_q6), .Q7(rowS13_q7), .Q8(rowS13_q8),
    .Q9(rowS13_q9));
  tri10 triS11 (
    .in(writeIn), .select(inst1_l),
    .out({triS11_out_10, triS11_out_9, triS11_out_8, triS11_out_7, triS11_out_6, triS11_out_5, triS11_out_4, triS11_out_3, triS11_out_2, triS11_out}));
  Row rowS10 (
    .D1(triS11_out_2), .D3(triS11_out_4), .D4(triS11_out_5), .D5(triS11_out_6), .D6(triS11_out_7),
    .D7(triS11_out_8), .D0(triS11_out), .D2(triS11_out_3), .D9(triS11_out_10), .D8(triS11_out_9),
    .Enable(inst1_l), .Clock(Clock), .Clear(Clear), .Q0(rowS10_q0), .Q1(rowS10_q1), .Q2(rowS10_q2),
    .Q3(rowS10_q3), .Q4(rowS10_q4), .Q5(rowS10_q5), .Q6(rowS10_q6), .Q7(rowS10_q7), .Q8(rowS10_q8),
    .Q9(rowS10_q9));
  tri10 triS13 (
    .in(writeIn), .select(inst1_k),
    .out({triS13_out_10, triS13_out_9, triS13_out_8, triS13_out_7, triS13_out_6, triS13_out_5, triS13_out_4, triS13_out_3, triS13_out_2, triS13_out}));
  Row rowS12 (
    .D1(triS13_out_2), .D3(triS13_out_4), .D4(triS13_out_5), .D5(triS13_out_6), .D6(triS13_out_7),
    .D7(triS13_out_8), .D0(triS13_out), .D2(triS13_out_3), .D9(triS13_out_10), .D8(triS13_out_9),
    .Enable(inst1_k), .Clock(Clock), .Clear(Clear), .Q0(rowS12_q0), .Q1(rowS12_q1), .Q2(rowS12_q2),
    .Q3(rowS12_q3), .Q4(rowS12_q4), .Q5(rowS12_q5), .Q6(rowS12_q6), .Q7(rowS12_q7), .Q8(rowS12_q8),
    .Q9(rowS12_q9));
  tri10 triS15 (
    .in(writeIn), .select(inst1_j),
    .out({triS15_out_10, triS15_out_9, triS15_out_8, triS15_out_7, triS15_out_6, triS15_out_5, triS15_out_4, triS15_out_3, triS15_out_2, triS15_out}));
  Row rowS14 (
    .D1(triS15_out_2), .D3(triS15_out_4), .D4(triS15_out_5), .D5(triS15_out_6), .D6(triS15_out_7),
    .D7(triS15_out_8), .D0(triS15_out), .D2(triS15_out_3), .D9(triS15_out_10), .D8(triS15_out_9),
    .Enable(inst1_j), .Clock(Clock), .Clear(Clear), .Q0(rowS14_q0), .Q1(rowS14_q1), .Q2(rowS14_q2),
    .Q3(rowS14_q3), .Q4(rowS14_q4), .Q5(rowS14_q5), .Q6(rowS14_q6), .Q7(rowS14_q7), .Q8(rowS14_q8),
    .Q9(rowS14_q9));
  tri10 triS16 (
    .in(writeIn), .select(inst1_i),
    .out({triS16_out_10, triS16_out_9, triS16_out_8, triS16_out_7, triS16_out_6, triS16_out_5, triS16_out_4, triS16_out_3, triS16_out_2, triS16_out}));
  Row rowS15 (
    .D1(triS16_out_2), .D3(triS16_out_4), .D4(triS16_out_5), .D5(triS16_out_6), .D6(triS16_out_7),
    .D7(triS16_out_8), .D0(triS16_out), .D2(triS16_out_3), .D9(triS16_out_10), .D8(triS16_out_9),
    .Enable(inst1_i), .Clock(Clock), .Clear(Clear), .Q0(rowS15_q0), .Q1(rowS15_q1), .Q2(rowS15_q2),
    .Q3(rowS15_q3), .Q4(rowS15_q4), .Q5(rowS15_q5), .Q6(rowS15_q6), .Q7(rowS15_q7), .Q8(rowS15_q8),
    .Q9(rowS15_q9));
  tri10 triS17 (
    .in(writeIn), .select(inst1_h),
    .out({triS17_out_10, triS17_out_9, triS17_out_8, triS17_out_7, triS17_out_6, triS17_out_5, triS17_out_4, triS17_out_3, triS17_out_2, triS17_out}));
  Row rowS16 (
    .D1(triS17_out_2), .D3(triS17_out_4), .D4(triS17_out_5), .D5(triS17_out_6), .D6(triS17_out_7),
    .D7(triS17_out_8), .D0(triS17_out), .D2(triS17_out_3), .D9(triS17_out_10), .D8(triS17_out_9),
    .Enable(inst1_h), .Clock(Clock), .Clear(Clear), .Q0(rowS16_q0), .Q1(rowS16_q1), .Q2(rowS16_q2),
    .Q3(rowS16_q3), .Q4(rowS16_q4), .Q5(rowS16_q5), .Q6(rowS16_q6), .Q7(rowS16_q7), .Q8(rowS16_q8),
    .Q9(rowS16_q9));
  tri10 triS18 (
    .in(writeIn), .select(inst1_g),
    .out({triS18_out_10, triS18_out_9, triS18_out_8, triS18_out_7, triS18_out_6, triS18_out_5, triS18_out_4, triS18_out_3, triS18_out_2, triS18_out}));
  Row rowS17 (
    .D1(triS18_out_2), .D3(triS18_out_4), .D4(triS18_out_5), .D5(triS18_out_6), .D6(triS18_out_7),
    .D7(triS18_out_8), .D0(triS18_out), .D2(triS18_out_3), .D9(triS18_out_10), .D8(triS18_out_9),
    .Enable(inst1_g), .Clock(Clock), .Clear(Clear), .Q0(rowS17_q0), .Q1(rowS17_q1), .Q2(rowS17_q2),
    .Q3(rowS17_q3), .Q4(rowS17_q4), .Q5(rowS17_q5), .Q6(rowS17_q6), .Q7(rowS17_q7), .Q8(rowS17_q8),
    .Q9(rowS17_q9));
  tri10 triS19 (
    .in(writeIn), .select(inst1_f),
    .out({triS19_out_10, triS19_out_9, triS19_out_8, triS19_out_7, triS19_out_6, triS19_out_5, triS19_out_4, triS19_out_3, triS19_out_2, triS19_out}));
  Row rowS18 (
    .D1(triS19_out_2), .D3(triS19_out_4), .D4(triS19_out_5), .D5(triS19_out_6), .D6(triS19_out_7),
    .D7(triS19_out_8), .D0(triS19_out), .D2(triS19_out_3), .D9(triS19_out_10), .D8(triS19_out_9),
    .Enable(inst1_f), .Clock(Clock), .Clear(Clear), .Q0(rowS18_q0), .Q1(rowS18_q1), .Q2(rowS18_q2),
    .Q3(rowS18_q3), .Q4(rowS18_q4), .Q5(rowS18_q5), .Q6(rowS18_q6), .Q7(rowS18_q7), .Q8(rowS18_q8),
    .Q9(rowS18_q9));
  tri10 triS20 (
    .in(writeIn), .select(inst1_e),
    .out({triS20_out_10, triS20_out_9, triS20_out_8, triS20_out_7, triS20_out_6, triS20_out_5, triS20_out_4, triS20_out_3, triS20_out_2, triS20_out}));
  Row rowS19 (
    .D1(triS20_out_2), .D3(triS20_out_4), .D4(triS20_out_5), .D5(triS20_out_6), .D6(triS20_out_7),
    .D7(triS20_out_8), .D0(triS20_out), .D2(triS20_out_3), .D9(triS20_out_10), .D8(triS20_out_9),
    .Enable(inst1_e), .Clock(Clock), .Clear(Clear), .Q0(rowS19_q0), .Q1(rowS19_q1), .Q2(rowS19_q2),
    .Q3(rowS19_q3), .Q4(rowS19_q4), .Q5(rowS19_q5), .Q6(rowS19_q6), .Q7(rowS19_q7), .Q8(rowS19_q8),
    .Q9(rowS19_q9));
  tri10 triS21 (
    .in(writeIn), .select(inst1_d),
    .out({triS21_out_10, triS21_out_9, triS21_out_8, triS21_out_7, triS21_out_6, triS21_out_5, triS21_out_4, triS21_out_3, triS21_out_2, triS21_out}));
  Row rowS20 (
    .D1(triS21_out_2), .D3(triS21_out_4), .D4(triS21_out_5), .D5(triS21_out_6), .D6(triS21_out_7),
    .D7(triS21_out_8), .D0(triS21_out), .D2(triS21_out_3), .D9(triS21_out_10), .D8(triS21_out_9),
    .Enable(inst1_d), .Clock(Clock), .Clear(Clear), .Q0(rowS20_q0), .Q1(rowS20_q1), .Q2(rowS20_q2),
    .Q3(rowS20_q3), .Q4(rowS20_q4), .Q5(rowS20_q5), .Q6(rowS20_q6), .Q7(rowS20_q7), .Q8(rowS20_q8),
    .Q9(rowS20_q9));
  tri10 triS22 (
    .in(writeIn), .select(inst1_c),
    .out({triS22_out_10, triS22_out_9, triS22_out_8, triS22_out_7, triS22_out_6, triS22_out_5, triS22_out_4, triS22_out_3, triS22_out_2, triS22_out}));
  Row rowS21 (
    .D1(triS22_out_2), .D3(triS22_out_4), .D4(triS22_out_5), .D5(triS22_out_6), .D6(triS22_out_7),
    .D7(triS22_out_8), .D0(triS22_out), .D2(triS22_out_3), .D9(triS22_out_10), .D8(triS22_out_9),
    .Enable(inst1_c), .Clock(Clock), .Clear(Clear), .Q0(rowS21_q0), .Q1(rowS21_q1), .Q2(rowS21_q2),
    .Q3(rowS21_q3), .Q4(rowS21_q4), .Q5(rowS21_q5), .Q6(rowS21_q6), .Q7(rowS21_q7), .Q8(rowS21_q8),
    .Q9(rowS21_q9));
  tri10 triS23 (
    .in(writeIn), .select(inst1_b),
    .out({triS23_out_10, triS23_out_9, triS23_out_8, triS23_out_7, triS23_out_6, triS23_out_5, triS23_out_4, triS23_out_3, triS23_out_2, triS23_out}));
  Row rowS22 (
    .D1(triS23_out_2), .D3(triS23_out_4), .D4(triS23_out_5), .D5(triS23_out_6), .D6(triS23_out_7),
    .D7(triS23_out_8), .D0(triS23_out), .D2(triS23_out_3), .D9(triS23_out_10), .D8(triS23_out_9),
    .Enable(inst1_b), .Clock(Clock), .Clear(Clear), .Q0(rowS22_q0), .Q1(rowS22_q1), .Q2(rowS22_q2),
    .Q3(rowS22_q3), .Q4(rowS22_q4), .Q5(rowS22_q5), .Q6(rowS22_q6), .Q7(rowS22_q7), .Q8(rowS22_q8),
    .Q9(rowS22_q9));
  tri10 triS24 (
    .in(writeIn), .select(inst1_a),
    .out({triS24_out_10, triS24_out_9, triS24_out_8, triS24_out_7, triS24_out_6, triS24_out_5, triS24_out_4, triS24_out_3, triS24_out_2, triS24_out}));
  Row rowS23 (
    .D1(triS24_out_2), .D3(triS24_out_4), .D4(triS24_out_5), .D5(triS24_out_6), .D6(triS24_out_7),
    .D7(triS24_out_8), .D0(triS24_out), .D2(triS24_out_3), .D9(triS24_out_10), .D8(triS24_out_9),
    .Enable(inst1_a), .Clock(Clock), .Clear(Clear), .Q0(rowS23_q0), .Q1(rowS23_q1), .Q2(rowS23_q2),
    .Q3(rowS23_q3), .Q4(rowS23_q4), .Q5(rowS23_q5), .Q6(rowS23_q6), .Q7(rowS23_q7), .Q8(rowS23_q8),
    .Q9(rowS23_q9));
  tri10 inst35 (
    .in({rowT_q0, rowT_q1, rowT_q2, rowT_q3, rowT_q4, rowT_q5, rowT_q6, rowT_q7, rowT_q8, rowT_q9}),
    .select(inst15_t),
    .out({inst35_out_10, inst35_out_9, inst35_out_8, inst35_out_7, inst35_out_6, inst35_out_5, inst35_out_4, inst35_out_3, inst35_out_2, inst35_out}));
  tri10 inst34 (
    .in({rowS_q0, rowS_q1, rowS_q2, rowS_q3, rowS_q4, rowS_q5, rowS_q6, rowS_q7, rowS_q8, rowS_q9}),
    .select(inst15_s),
    .out({inst34_out_10, inst34_out_9, inst34_out_8, inst34_out_7, inst34_out_6, inst34_out_5, inst34_out_4, inst34_out_3, inst34_out, inst34_out_2}));
  tri10 inst33 (
    .in({rowS33_q0, rowS33_q1, rowS33_q2, rowS33_q3, rowS33_q4, rowS33_q5, rowS33_q6, rowS33_q7, rowS33_q8, rowS33_q9}),
    .select(inst15_r),
    .out({inst33_out_10, inst33_out_9, inst33_out_8, inst33_out_7, inst33_out_6, inst33_out_5, inst33_out_4, inst33_out_3, inst33_out, inst33_out_2}));
  tri10 inst32 (
    .in({rowS5_q0, rowS5_q1, rowS5_q2, rowS5_q3, rowS5_q4, rowS5_q5, rowS5_q6, rowS5_q7, rowS5_q8, rowS5_q9}),
    .select(inst15_q),
    .out({inst32_out_10, inst32_out_9, inst32_out_8, inst32_out_7, inst32_out_6, inst32_out_5, inst32_out_4, inst32_out_3, inst32_out, inst32_out_2}));
  tri10 inst31 (
    .in({rowS7_q0, rowS7_q1, rowS7_q2, rowS7_q3, rowS7_q4, rowS7_q5, rowS7_q6, rowS7_q7, rowS7_q8, rowS7_q9}),
    .select(inst15_p),
    .out({inst31_out_10, inst31_out_9, inst31_out_8, inst31_out_7, inst31_out_6, inst31_out_5, inst31_out_4, inst31_out_3, inst31_out, inst31_out_2}));
  tri10 inst30 (
    .in({rowS9_q0, rowS9_q1, rowS9_q2, rowS9_q3, rowS9_q4, rowS9_q5, rowS9_q6, rowS9_q7, rowS9_q8, rowS9_q9}),
    .select(inst15_o),
    .out({inst30_out_10, inst30_out_9, inst30_out_8, inst30_out_7, inst30_out_6, inst30_out_5, inst30_out_4, inst30_out_3, inst30_out, inst30_out_2}));
  tri10 inst29 (
    .in({rowS11_q0, rowS11_q1, rowS11_q2, rowS11_q3, rowS11_q4, rowS11_q5, rowS11_q6, rowS11_q7, rowS11_q8, rowS11_q9}),
    .select(inst15_n),
    .out({inst29_out_10, inst29_out_9, inst29_out_8, inst29_out_7, inst29_out_6, inst29_out_5, inst29_out_4, inst29_out_3, inst29_out, inst29_out_2}));
  tri10 inst28 (
    .in({rowS13_q0, rowS13_q1, rowS13_q2, rowS13_q3, rowS13_q4, rowS13_q5, rowS13_q6, rowS13_q7, rowS13_q8, rowS13_q9}),
    .select(inst15_m),
    .out({inst28_out_10, inst28_out_9, inst28_out_8, inst28_out_7, inst28_out_6, inst28_out_5, inst28_out_4, inst28_out_3, inst28_out, inst28_out_2}));
  tri10 inst27 (
    .in({rowS10_q0, rowS10_q1, rowS10_q2, rowS10_q3, rowS10_q4, rowS10_q5, rowS10_q6, rowS10_q7, rowS10_q8, rowS10_q9}),
    .select(inst15_l),
    .out({inst27_out_10, inst27_out_9, inst27_out_8, inst27_out_7, inst27_out_6, inst27_out_5, inst27_out_4, inst27_out_3, inst27_out, inst27_out_2}));
  tri10 inst26 (
    .in({rowS12_q0, rowS12_q1, rowS12_q2, rowS12_q3, rowS12_q4, rowS12_q5, rowS12_q6, rowS12_q7, rowS12_q8, rowS12_q9}),
    .select(inst15_k),
    .out({inst26_out_10, inst26_out_9, inst26_out_8, inst26_out_7, inst26_out_6, inst26_out_5, inst26_out_4, inst26_out_3, inst26_out, inst26_out_2}));
  tri10 inst25 (
    .in({rowS14_q0, rowS14_q1, rowS14_q2, rowS14_q3, rowS14_q4, rowS14_q5, rowS14_q6, rowS14_q7, rowS14_q8, rowS14_q9}),
    .select(inst15_j),
    .out({inst25_out_10, inst25_out_9, inst25_out_8, inst25_out_7, inst25_out_6, inst25_out_5, inst25_out_4, inst25_out_3, inst25_out, inst25_out_2}));
  tri10 inst24 (
    .in({rowS15_q0, rowS15_q1, rowS15_q2, rowS15_q3, rowS15_q4, rowS15_q5, rowS15_q6, rowS15_q7, rowS15_q8, rowS15_q9}),
    .select(inst15_i),
    .out({inst24_out_10, inst24_out_9, inst24_out_8, inst24_out_7, inst24_out_6, inst24_out_5, inst24_out_4, inst24_out_3, inst24_out, inst24_out_2}));
  tri10 inst23 (
    .in({rowS16_q0, rowS16_q1, rowS16_q2, rowS16_q3, rowS16_q4, rowS16_q5, rowS16_q6, rowS16_q7, rowS16_q8, rowS16_q9}),
    .select(inst15_h),
    .out({inst23_out_10, inst23_out_9, inst23_out_8, inst23_out_7, inst23_out_6, inst23_out_5, inst23_out_4, inst23_out_3, inst23_out, inst23_out_2}));
  tri10 inst22 (
    .in({rowS17_q0, rowS17_q1, rowS17_q2, rowS17_q3, rowS17_q4, rowS17_q5, rowS17_q6, rowS17_q7, rowS17_q8, rowS17_q9}),
    .select(inst15_g),
    .out({inst22_out_10, inst22_out_9, inst22_out_8, inst22_out_7, inst22_out_6, inst22_out_5, inst22_out_4, inst22_out_3, inst22_out, inst22_out_2}));
  tri10 inst21 (
    .in({rowS18_q0, rowS18_q1, rowS18_q2, rowS18_q3, rowS18_q4, rowS18_q5, rowS18_q6, rowS18_q7, rowS18_q8, rowS18_q9}),
    .select(inst15_f),
    .out({inst21_out_10, inst21_out_9, inst21_out_8, inst21_out_7, inst21_out_6, inst21_out_5, inst21_out_4, inst21_out_3, inst21_out, inst21_out_2}));
  tri10 inst20 (
    .in({rowS19_q0, rowS19_q1, rowS19_q2, rowS19_q3, rowS19_q4, rowS19_q5, rowS19_q6, rowS19_q7, rowS19_q8, rowS19_q9}),
    .select(inst15_e),
    .out({inst20_out_10, inst20_out_9, inst20_out_8, inst20_out_7, inst20_out_6, inst20_out_5, inst20_out_4, inst20_out_3, inst20_out, inst20_out_2}));
  tri10 inst19 (
    .in({rowS20_q0, rowS20_q1, rowS20_q2, rowS20_q3, rowS20_q4, rowS20_q5, rowS20_q6, rowS20_q7, rowS20_q8, rowS20_q9}),
    .select(inst15_d),
    .out({inst19_out_10, inst19_out_6, inst19_out_9, inst19_out_8, inst19_out_7, inst19_out_5, inst19_out_4, inst19_out_3, inst19_out, inst19_out_2}));
  tri10 inst18 (
    .in({rowS21_q0, rowS21_q1, rowS21_q2, rowS21_q3, rowS21_q4, rowS21_q5, rowS21_q6, rowS21_q7, rowS21_q8, rowS21_q9}),
    .select(inst15_c),
    .out({inst18_out_8, inst18_out_7, inst18_out_10, inst18_out_9, inst18_out_6, inst18_out_5, inst18_out_4, inst18_out_3, inst18_out, inst18_out_2}));
  tri10 inst17 (
    .in({rowS22_q0, rowS22_q1, rowS22_q2, rowS22_q3, rowS22_q4, rowS22_q5, rowS22_q6, rowS22_q7, rowS22_q8, rowS22_q9}),
    .select(inst15_b),
    .out({inst17_out_9, inst17_out_8, inst17_out_10, inst17_out_5, inst17_out_7, inst17_out_6, inst17_out_4, inst17_out_3, inst17_out, inst17_out_2}));
  tri10 inst (
    .in({rowS23_q0, rowS23_q1, rowS23_q2, rowS23_q3, rowS23_q4, rowS23_q5, rowS23_q6, rowS23_q7, rowS23_q8, rowS23_q9}),
    .select(inst15_a),
    .out({inst_out_10, inst_out_9, inst_out_8, inst_out_7, inst_out_6, inst_out_5, inst_out_4, inst_out_3, inst_out, inst_out_2}));
  Demux inst15 (
    .S4(read[4]), .S3(read[3]), .S2(read[2]), .S1(read[1]), .S0(read[0]), .Input(1'b1), .T(inst15_t),
    .S(inst15_s), .R(inst15_r), .Q(inst15_q), .P(inst15_p), .O(inst15_o), .N(inst15_n), .M(inst15_m),
    .L(inst15_l), .K(inst15_k), .J(inst15_j), .I(inst15_i), .H(inst15_h), .G(inst15_g), .F(inst15_f),
    .E(inst15_e), .D(inst15_d), .C(inst15_c), .B(inst15_b), .A(inst15_a));
  myOr20 inst41 (
    .in({inst_out_2, inst17_out_2, inst18_out_2, inst19_out_2, inst20_out_2, inst21_out_2, inst22_out_2, inst23_out_2, inst24_out_2, inst25_out_2, inst26_out_2, inst27_out_2, inst28_out_2, inst29_out_2, inst30_out_2, inst31_out_2, inst32_out_2, inst33_out_2, inst34_out_2, inst35_out}),
    .out(readOut[9]));
  myOr20 inst42 (
    .in({inst_out, inst17_out, inst18_out, inst19_out, inst20_out, inst21_out, inst22_out, inst23_out, inst24_out, inst25_out, inst26_out, inst27_out, inst28_out, inst29_out, inst30_out, inst31_out, inst32_out, inst33_out, inst34_out, inst35_out_2}),
    .out(readOut[8]));
  myOr20 inst43 (
    .in({inst_out_3, inst17_out_3, inst18_out_3, inst19_out_3, inst20_out_3, inst21_out_3, inst22_out_3, inst23_out_3, inst24_out_3, inst25_out_3, inst26_out_3, inst27_out_3, inst28_out_3, inst29_out_3, inst30_out_3, inst31_out_3, inst32_out_3, inst33_out_3, inst34_out_3, inst35_out_3}),
    .out(readOut[7]));
  myOr20 inst44 (
    .in({inst_out_4, inst17_out_4, inst18_out_4, inst19_out_4, inst20_out_4, inst21_out_4, inst22_out_4, inst23_out_4, inst24_out_4, inst25_out_4, inst26_out_4, inst27_out_4, inst28_out_4, inst29_out_4, inst30_out_4, inst31_out_4, inst32_out_4, inst33_out_4, inst34_out_4, inst35_out_4}),
    .out(readOut[6]));
  myOr20 inst45 (
    .in({inst_out_5, inst17_out_6, inst18_out_5, inst19_out_5, inst20_out_5, inst21_out_5, inst22_out_5, inst23_out_5, inst24_out_5, inst25_out_5, inst26_out_5, inst27_out_5, inst28_out_5, inst29_out_5, inst30_out_5, inst31_out_5, inst32_out_5, inst33_out_5, inst34_out_5, inst35_out_5}),
    .out(readOut[5]));
  myOr20 inst46 (
    .in({inst_out_6, inst17_out_7, inst18_out_6, inst19_out_7, inst20_out_6, inst21_out_6, inst22_out_6, inst23_out_6, inst24_out_6, inst25_out_6, inst26_out_6, inst27_out_6, inst28_out_6, inst29_out_6, inst30_out_6, inst31_out_6, inst32_out_6, inst33_out_6, inst34_out_6, inst35_out_6}),
    .out(readOut[4]));
  myOr20 inst47 (
    .in({inst_out_7, inst17_out_5, inst18_out_9, inst19_out_8, inst20_out_7, inst21_out_7, inst22_out_7, inst23_out_7, inst24_out_7, inst25_out_7, inst26_out_7, inst27_out_7, inst28_out_7, inst29_out_7, inst30_out_7, inst31_out_7, inst32_out_7, inst33_out_7, inst34_out_7, inst35_out_7}),
    .out(readOut[3]));
  myOr20 inst48 (
    .in({inst_out_8, inst17_out_10, inst18_out_10, inst19_out_9, inst20_out_8, inst21_out_8, inst22_out_8, inst23_out_8, inst24_out_8, inst25_out_8, inst26_out_8, inst27_out_8, inst28_out_8, inst29_out_8, inst30_out_8, inst31_out_8, inst32_out_8, inst33_out_8, inst34_out_8, inst35_out_8}),
    .out(readOut[2]));
  myOr20 inst49 (
    .in({inst_out_9, inst17_out_8, inst18_out_7, inst19_out_6, inst20_out_9, inst21_out_9, inst22_out_9, inst23_out_9, inst24_out_9, inst25_out_9, inst26_out_9, inst27_out_9, inst28_out_9, inst29_out_9, inst30_out_9, inst31_out_9, inst32_out_9, inst33_out_9, inst34_out_9, inst35_out_9}),
    .out(readOut[1]));
  myOr20 inst50 (
    .in({inst_out_10, inst17_out_9, inst18_out_8, inst19_out_10, inst20_out_10, inst21_out_10, inst22_out_10, inst23_out_10, inst24_out_10, inst25_out_10, inst26_out_10, inst27_out_10, inst28_out_10, inst29_out_10, inst30_out_10, inst31_out_10, inst32_out_10, inst33_out_10, inst34_out_10, inst35_out_10}),
    .out(readOut[0]));

  // Notes on the sheet:
  //   Inverted due to Row Alignment
endmodule
